# EAGLE board nedo1802_v1_0 (EAGLE 5.01), part 1 of 2
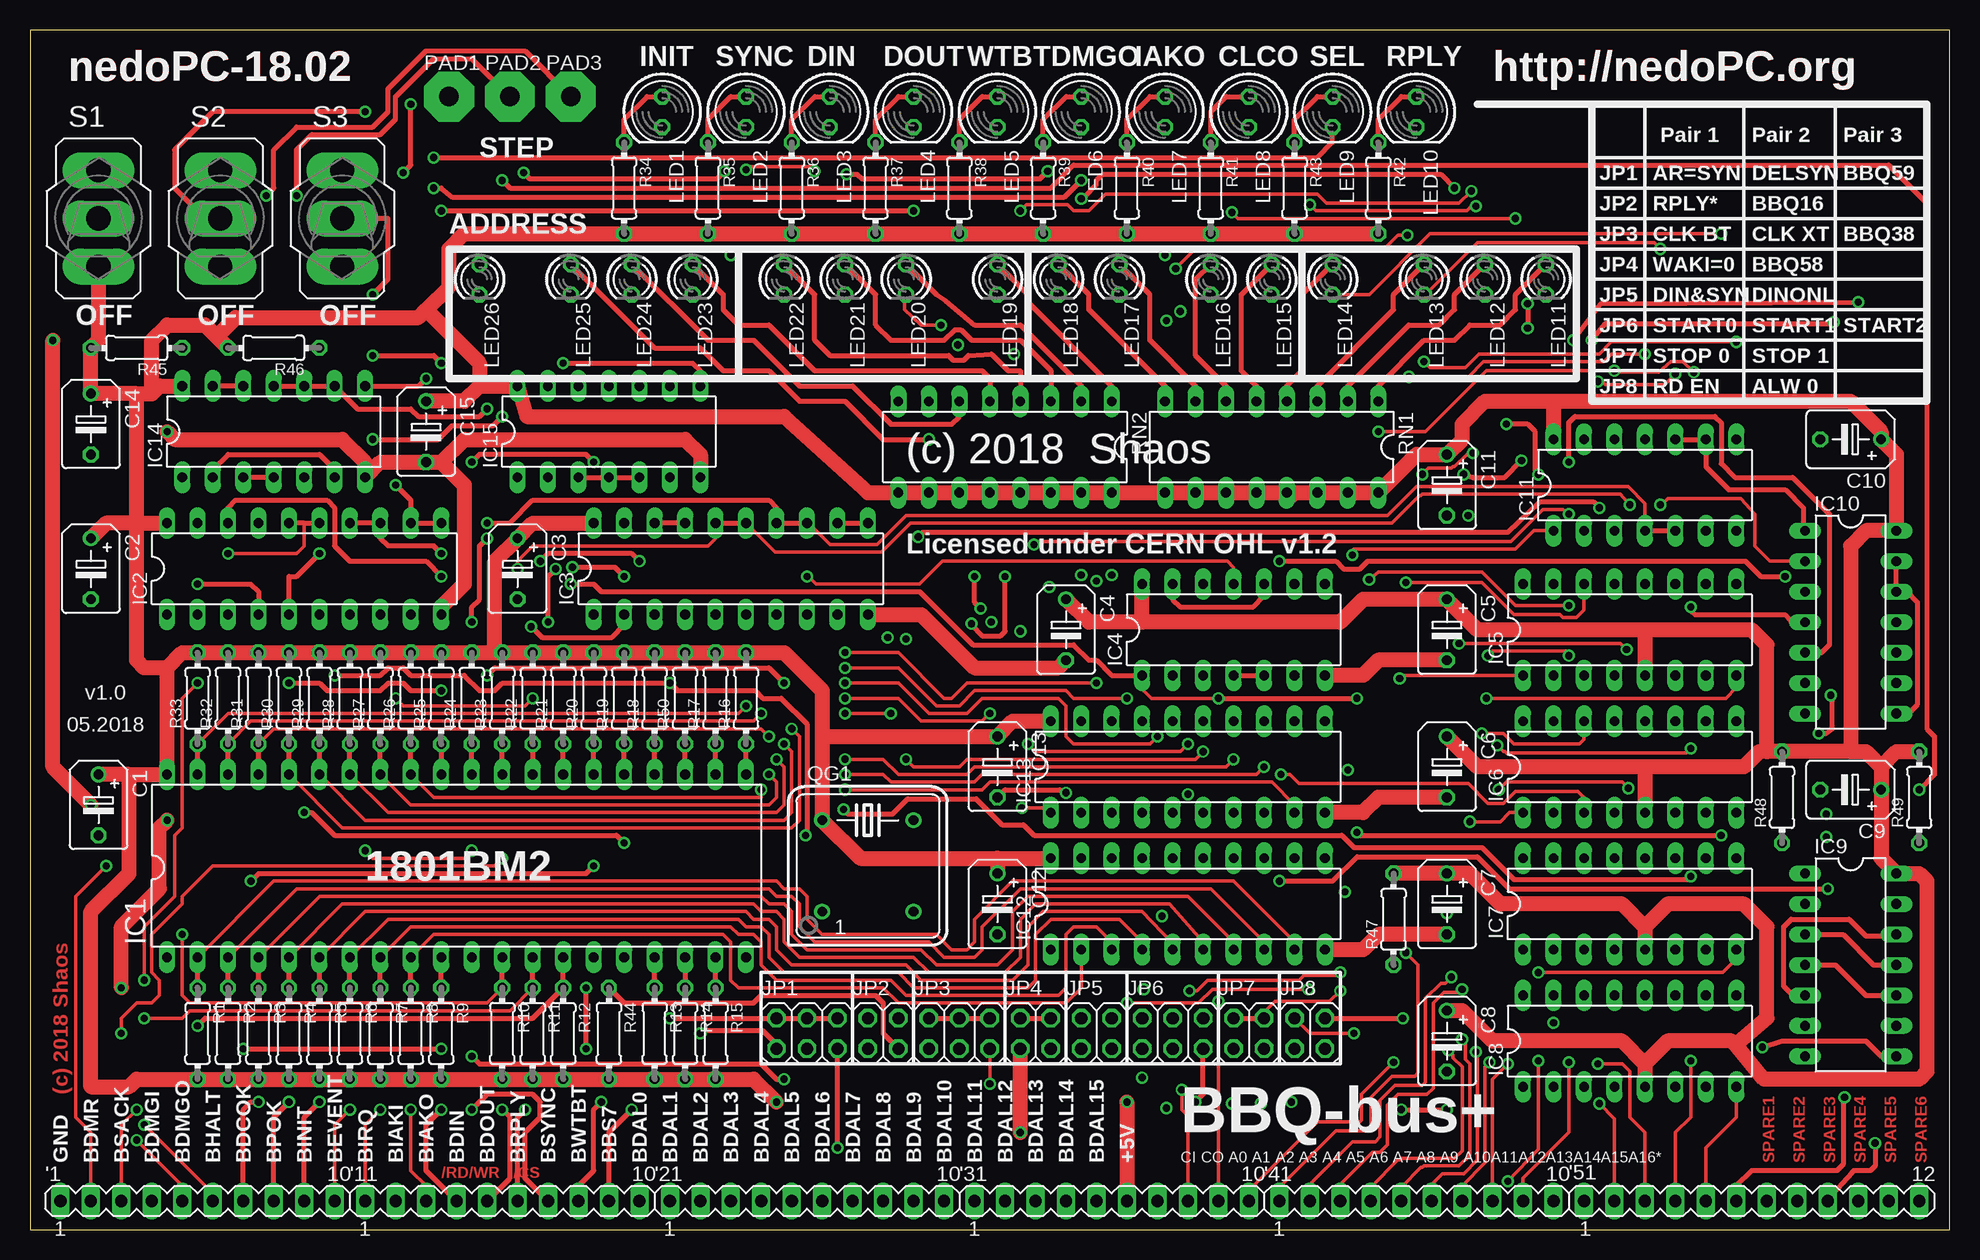
[diagram p2: board, top side]
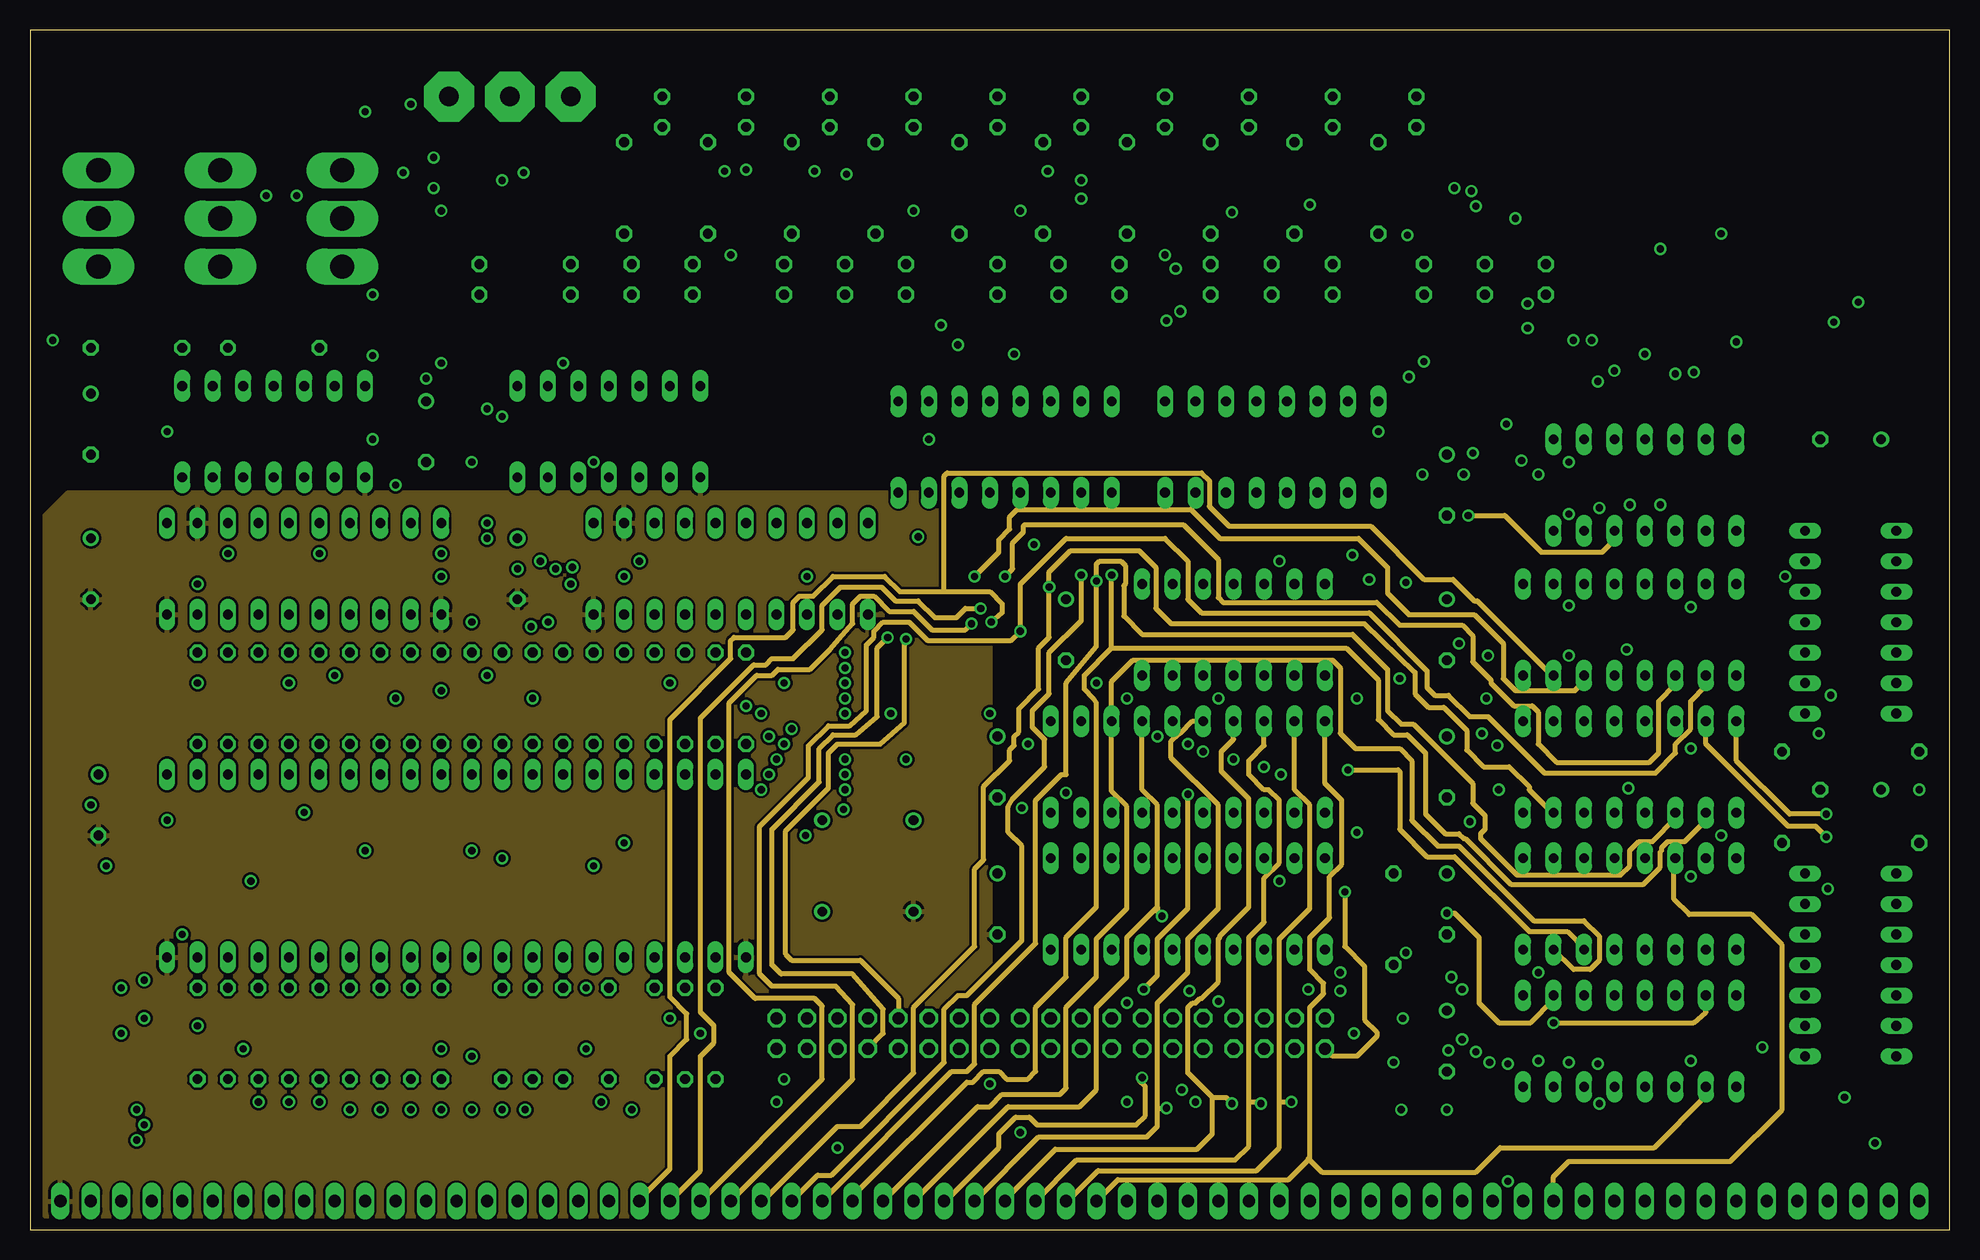
[diagram p3: board, inner layer Route2]
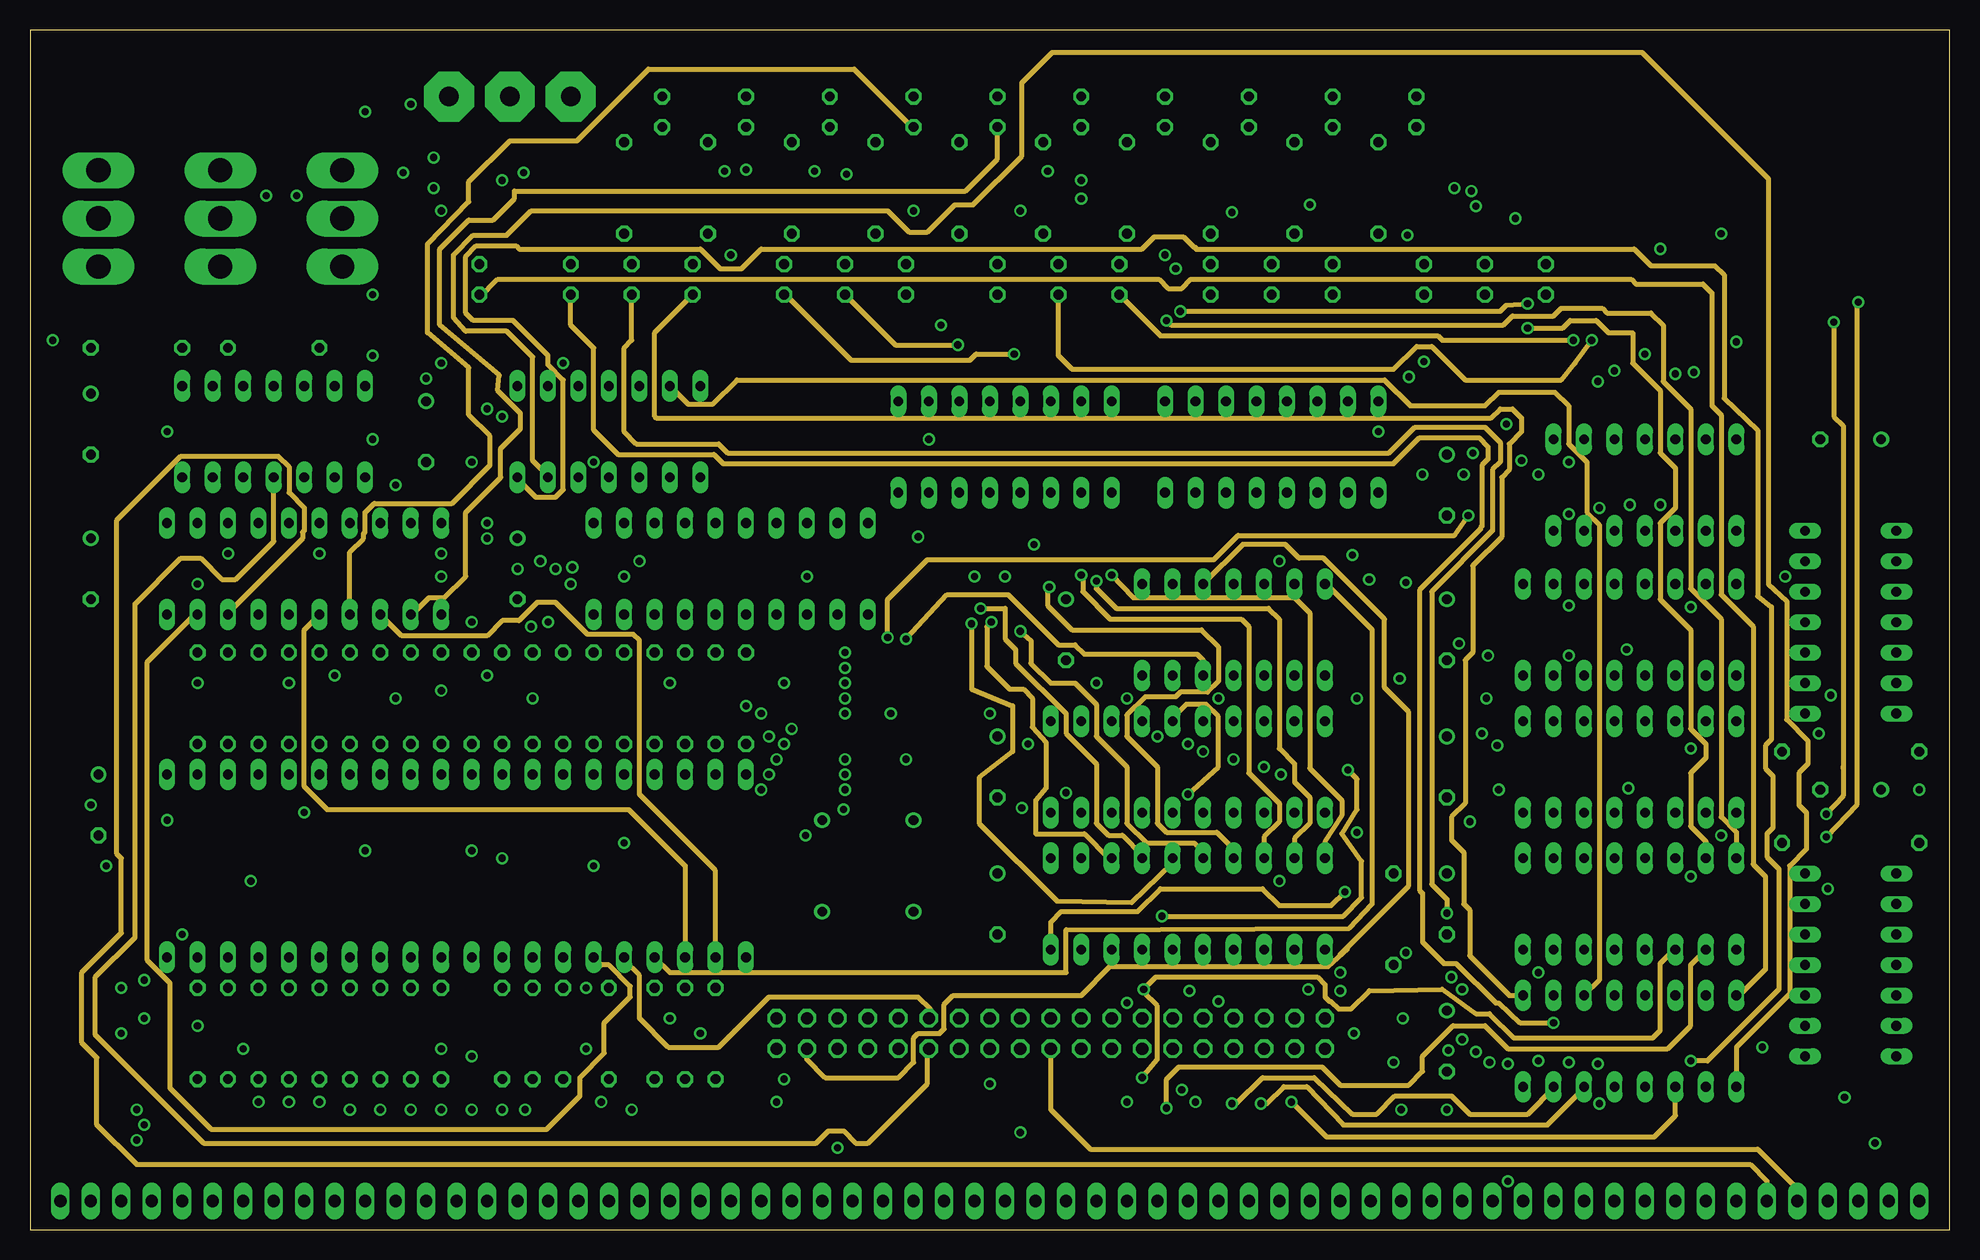
[diagram p4: board, inner layer Route15]
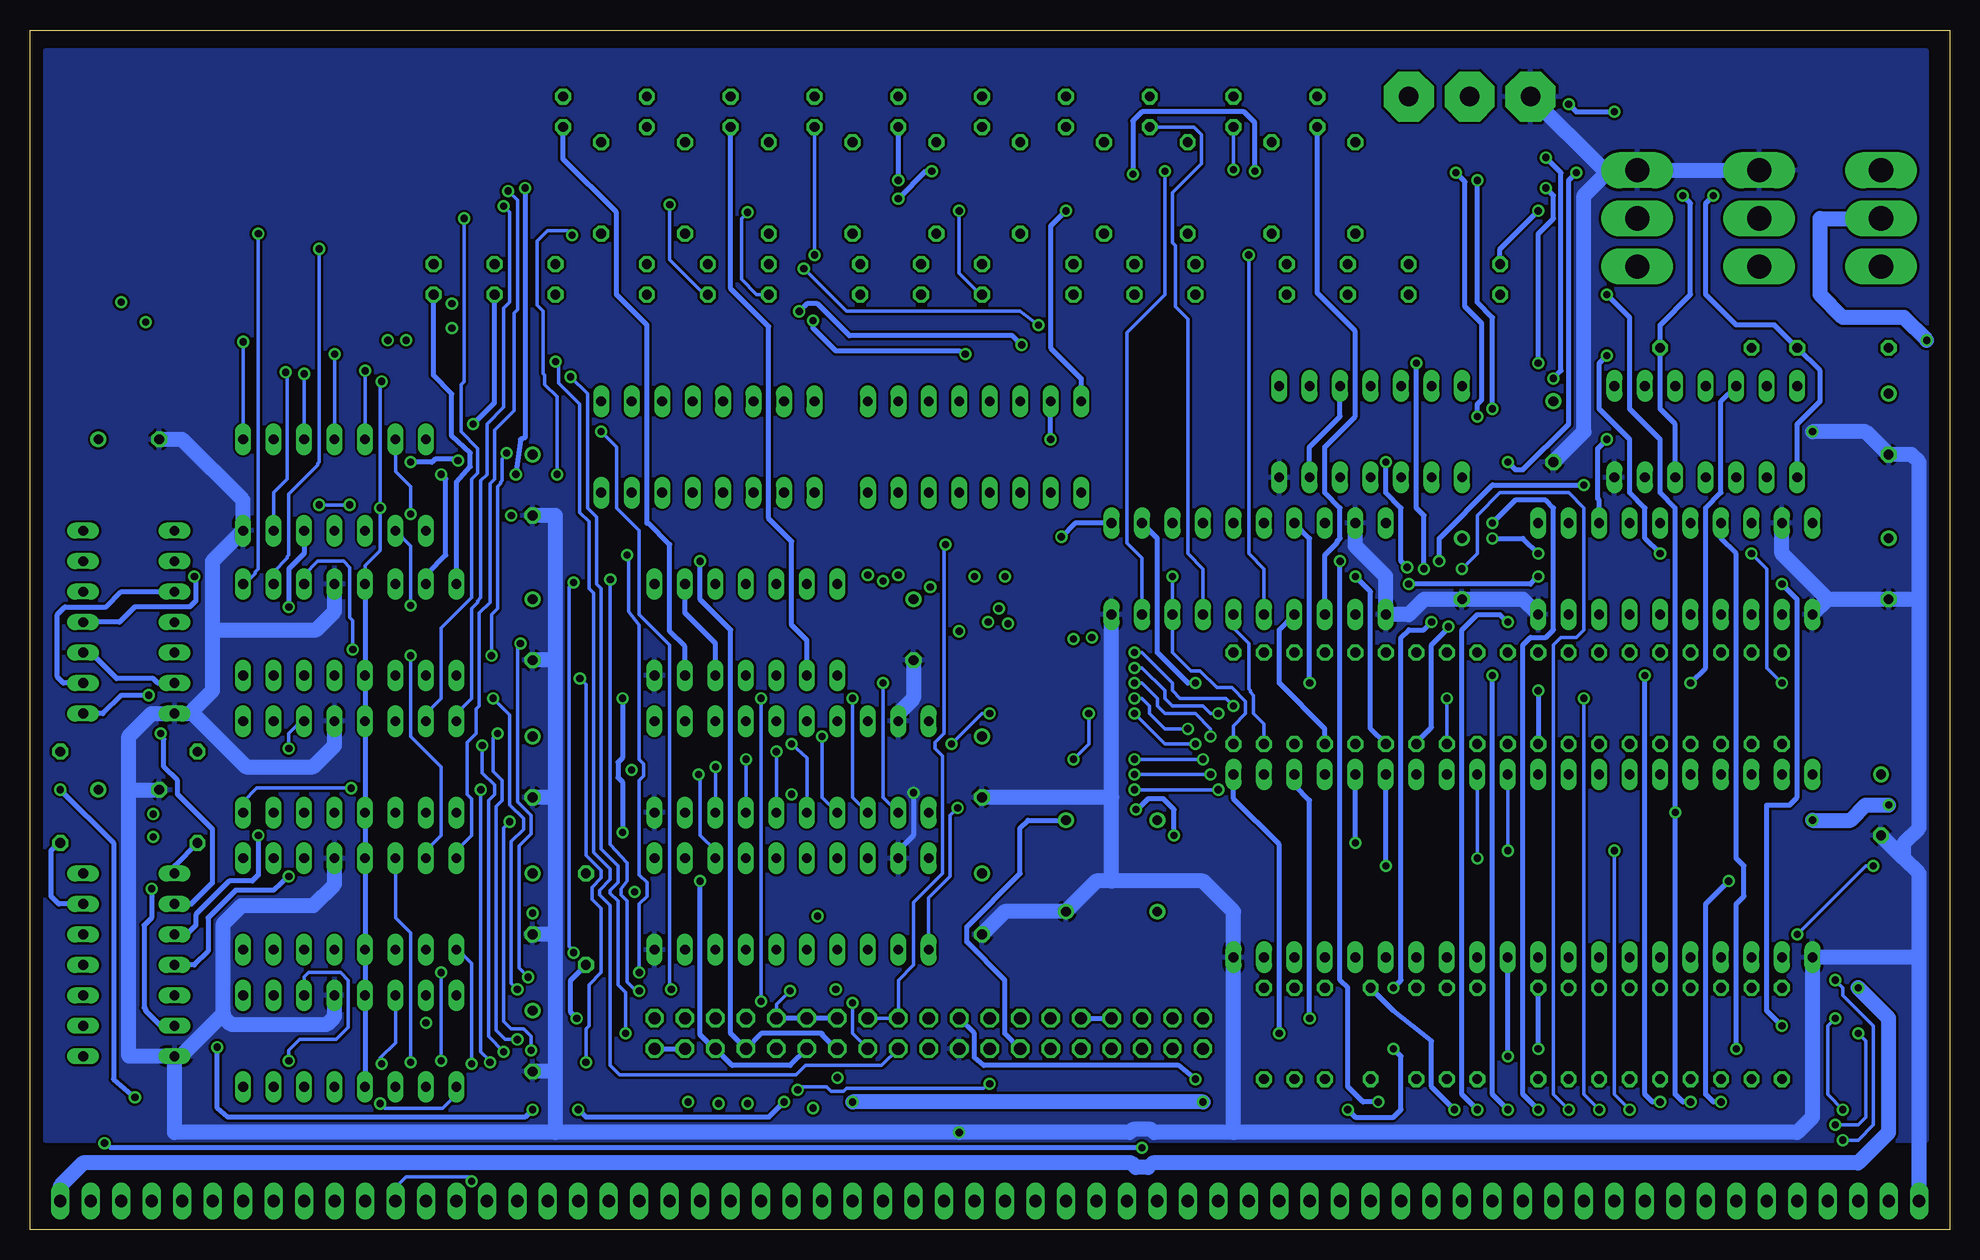
[diagram p5: board, bottom side, seen from below]

Size 160 x 100 mm. Coordinates in mm from the lower left corner, seen from the top.
Outline: 0,0 160,0 160,100 0,100 0,0
Copper layers (1+2*15+16): Top 0.035mm / dielectric 1.5mm / Route2 0.035mm / dielectric 0.15mm / Route15 0.035mm / dielectric 0.2mm / Bottom 0.035mm
Design rules "default *": minimum track width 6mil, minimum drill 20mil, track to track 8mil, track to pad 8mil, pad to pad 8mil, via to via 8mil, smd to smd 8mil, copper to edge 20mil, drill to drill 8mil, minimum pad ring 10mil, minimum via ring 8mil, stop-mask expansion 4mil, vias tented up to drill 0mil, thermal gap 10mil

## Footprints (pad centres in the part's own frame; a part is rotated, then mirrored left to right if it is on the bottom)
MA10-1 = drill 1.016 long: 1 -11.43,0; 2 -8.89,0; 3 -6.35,0; 4 -3.81,0; 5 -1.27,0; 6 1.27,0; 7 3.81,0; 8 6.35,0; 9 8.89,0; 10 11.43,0
MA12-1 = drill 1.016 long: 1 -13.97,0; 2 -11.43,0; 3 -8.89,0; 4 -6.35,0; 5 -3.81,0; 6 -1.27,0; 7 1.27,0; 8 3.81,0; 9 6.35,0; 10 8.89,0; 11 11.43,0; 12 13.97,0
B45181B = drill 0.813 round: + -2.54,0 | drill 0.813 octagon: - 2.54,0
DIL40 = drill 0.813 long: 1 -24.13,-7.62; 2 -21.59,-7.62; 3 -19.05,-7.62; 4 -16.51,-7.62; 5 -13.97,-7.62; 6 -11.43,-7.62; 7 -8.89,-7.62; 8 -6.35,-7.62; 9 -3.81,-7.62; 10 -1.27,-7.62; 11 1.27,-7.62; 12 3.81,-7.62; 13 6.35,-7.62; 14 8.89,-7.62; 15 11.43,-7.62; 16 13.97,-7.62; 17 16.51,-7.62; 18 19.05,-7.62; 19 21.59,-7.62; 20 24.13,-7.62; 21 24.13,7.62; 22 21.59,7.62; 23 19.05,7.62; 24 16.51,7.62; 25 13.97,7.62; 26 11.43,7.62; 27 8.89,7.62; 28 6.35,7.62; 29 3.81,7.62; 30 1.27,7.62; 31 -1.27,7.62; 32 -3.81,7.62; 33 -6.35,7.62; 34 -8.89,7.62; 35 -11.43,7.62; 36 -13.97,7.62; 37 -16.51,7.62; 38 -19.05,7.62; 39 -21.59,7.62; 40 -24.13,7.62
DIL20 = drill 0.813 long: 1 -11.43,-3.81; 2 -8.89,-3.81; 3 -6.35,-3.81; 4 -3.81,-3.81; 5 -1.27,-3.81; 6 1.27,-3.81; 7 3.81,-3.81; 8 6.35,-3.81; 9 8.89,-3.81; 10 11.43,-3.81; 11 11.43,3.81; 12 8.89,3.81; 13 6.35,3.81; 14 3.81,3.81; 15 1.27,3.81; 16 -1.27,3.81; 17 -3.81,3.81; 18 -6.35,3.81; 19 -8.89,3.81; 20 -11.43,3.81
DIL14 = drill 0.813 long: 1 -7.62,-3.81; 2 -5.08,-3.81; 3 -2.54,-3.81; 4 0,-3.81; 5 2.54,-3.81; 6 5.08,-3.81; 7 7.62,-3.81; 8 7.62,3.81; 9 5.08,3.81; 10 2.54,3.81; 11 0,3.81; 12 -2.54,3.81; 13 -5.08,3.81; 14 -7.62,3.81
DIL16 = drill 0.813 long: 1 -8.89,-3.81; 2 -6.35,-3.81; 3 -3.81,-3.81; 4 -1.27,-3.81; 5 1.27,-3.81; 6 3.81,-3.81; 7 6.35,-3.81; 8 8.89,-3.81; 9 8.89,3.81; 10 6.35,3.81; 11 3.81,3.81; 12 1.27,3.81; 13 -1.27,3.81; 14 -3.81,3.81; 15 -6.35,3.81; 16 -8.89,3.81
2X03 = drill 1.016 octagon: 1 -2.54,-1.27; 2 -2.54,1.27; 3 0,-1.27; 4 0,1.27; 5 2.54,-1.27; 6 2.54,1.27
2X02 = drill 1.016 octagon: 1 -1.27,-1.27; 2 -1.27,1.27; 3 1.27,-1.27; 4 1.27,1.27
LED5MM = drill 0.813 octagon: A -1.27,0; K 1.27,0
LED3MM = drill 0.813 octagon: A -1.27,0; K 1.27,0
4,16O1,6 = drill 1.6 pad 4.166 octagon: 1 0,0
DIL08S = drill 0.813 round: 1 -3.81,-3.81; 4 3.81,-3.81; 5 3.81,3.81; 8 -3.81,3.81
0204/7 = drill 0.813 octagon: 1 -3.81,0; 2 3.81,0
320-916 = drill 2.007 long: 1 0,4.013; 2 0,0; 3 0,-4.013

## Placement (x,y rotation side)
'1  [MA10-1]  13.97,2.38 0 top
'11  [MA10-1]  39.37,2.38 0 top
'21  [MA10-1]  64.77,2.38 0 top
'31  [MA10-1]  90.16,2.38 0 top
'41  [MA10-1]  115.56,2.38 0 top
'51  [MA12-1]  143.5,2.38 0 top
C1  0.1  [B45181B]  5.71,35.39 270 top
C2  0.1  [B45181B]  5.08,55.08 270 top
C3  0.1  [B45181B]  40.64,55.08 270 top
C4  0.1  [B45181B]  86.35,50 270 top
C5  0.1  [B45181B]  118.1,50 270 top
C6  0.1  [B45181B]  118.1,38.57 270 top
C7  0.1  [B45181B]  118.1,27.14 270 top
C8  0.1  [B45181B]  118.1,15.71 270 top
C9  0.1  [B45181B]  151.76,36.66 180 top
C10  0.1  [B45181B]  151.76,65.88 180 top
C11  0.1  [B45181B]  118.1,62.06 270 top
C12  0.1  [B45181B]  80.64,27.14 270 top
C13  0.1  [B45181B]  80.64,38.57 270 top
C14  0.1  [B45181B]  5.08,67.14 270 top
C15  0.1  [B45181B]  33.02,66.51 270 top
IC1  1801BM2  [DIL40]  35.55,30.31 0 top
IC2  74LS244N  [DIL20]  22.86,55.08 0 top
IC3  74LS244N  [DIL20]  58.41,55.08 0 top
IC4  74LS04N  [DIL14]  100.32,50 0 top
IC5  74LS75N  [DIL16]  133.34,50 0 top
IC6  74LS75N  [DIL16]  133.34,38.57 0 top
IC7  74LS75N  [DIL16]  133.34,27.14 0 top
IC8  74LS75N  [DIL16]  133.34,15.71 0 top
IC9  74LS74N  [DIL14]  151.76,22.06 270 top
IC10  74LS00N  [DIL14]  151.76,50.63 270 top
IC11  74LS00N  [DIL14]  134.62,62.06 0 top
IC12  74LS245N  [DIL20]  96.52,27.14 0 top
IC13  74LS245N  [DIL20]  96.52,38.57 0 top
IC14  74LS00N  [DIL14]  20.31,66.51 0 top
IC15  74LS00N  [DIL14]  48.26,66.51 0 top
JP1  [2X03]  64.77,16.34 0 top
JP2  [2X02]  71.11,16.34 0 top
JP3  [2X03]  77.46,16.34 0 top
JP4  [2X02]  83.81,16.34 0 top
JP5  [2X02]  88.89,16.34 0 top
JP6  [2X03]  95.24,16.34 0 top
JP7  [2X02]  101.59,16.34 0 top
JP8  [2X02]  106.67,16.34 0 top
LED1  [LED5MM]  52.7,93.18 270 top
LED2  [LED5MM]  59.69,93.18 270 top
LED3  [LED5MM]  66.67,93.18 270 top
LED4  [LED5MM]  73.66,93.18 270 top
LED5  [LED5MM]  80.64,93.18 270 top
LED6  [LED5MM]  87.62,93.18 270 top
LED7  [LED5MM]  94.61,93.18 270 top
LED8  [LED5MM]  101.59,93.18 270 top
LED9  [LED5MM]  108.58,93.18 270 top
LED10  [LED5MM]  115.56,93.18 270 top
LED11  [LED3MM]  126.36,79.21 270 top
LED12  [LED3MM]  121.28,79.21 270 top
LED13  [LED3MM]  116.2,79.21 270 top
LED14  [LED3MM]  108.58,79.21 270 top
LED15  [LED3MM]  103.5,79.21 270 top
LED16  [LED3MM]  98.42,79.21 270 top
LED17  [LED3MM]  90.8,79.21 270 top
LED18  [LED3MM]  85.72,79.21 270 top
LED19  [LED3MM]  80.64,79.21 270 top
LED20  [LED3MM]  73.02,79.21 270 top
LED21  [LED3MM]  67.94,79.21 270 top
LED22  [LED3MM]  62.86,79.21 270 top
LED23  [LED3MM]  55.24,79.21 270 top
LED24  [LED3MM]  50.16,79.21 270 top
LED25  [LED3MM]  45.08,79.21 270 top
LED26  [LED3MM]  37.46,79.21 270 top
PAD1  CO  [4,16O1,6]  34.92,94.45 0 top
PAD2  NO  [4,16O1,6]  40,94.45 0 top
PAD3  NC  [4,16O1,6]  45.08,94.45 0 top
QG1  [DIL08S]  69.84,30.31 0 top
R1  2K  [0204/7]  13.97,16.34 270 top
R2  2K  [0204/7]  16.5,16.34 270 top
R3  2K  [0204/7]  19.04,16.34 270 top
R4  2K  [0204/7]  21.58,16.34 270 top
R5  2K  [0204/7]  24.12,16.34 270 top
R6  2K  [0204/7]  26.66,16.34 270 top
R7  2K  [0204/7]  29.2,16.34 270 top
R8  2K  [0204/7]  31.74,16.34 270 top
R9  2K  [0204/7]  34.29,16.34 270 top
R10  2K  [0204/7]  39.37,16.34 270 top
R11  2K  [0204/7]  41.91,16.34 270 top
R12  2K  [0204/7]  44.45,16.34 270 top
R13  2K  [0204/7]  52.07,16.34 270 top
R14  2K  [0204/7]  54.61,16.34 270 top
R15  2K  [0204/7]  57.15,16.34 270 top
R16  2K  [0204/7]  59.69,44.28 90 top
R17  2K  [0204/7]  57.15,44.28 90 top
R18  2K  [0204/7]  52.07,44.28 90 top
R19  2K  [0204/7]  49.53,44.28 90 top
R20  2K  [0204/7]  46.98,44.28 90 top
R21  2K  [0204/7]  44.45,44.28 90 top
R22  2K  [0204/7]  41.91,44.28 90 top
R23  2K  [0204/7]  39.37,44.28 90 top
R24  2K  [0204/7]  36.83,44.28 90 top
R25  2K  [0204/7]  34.29,44.28 90 top
R26  2K  [0204/7]  31.74,44.28 90 top
R27  2K  [0204/7]  29.2,44.28 90 top
R28  2K  [0204/7]  26.66,44.28 90 top
R29  2K  [0204/7]  24.12,44.28 90 top
R30  2K  [0204/7]  21.58,44.28 90 top
R31  2K  [0204/7]  19.04,44.28 90 top
R32  2K  [0204/7]  16.5,44.28 90 top
R33  2K  [0204/7]  13.97,44.28 90 top
R34  1K  [0204/7]  49.53,86.83 270 top
R35  1K  [0204/7]  56.51,86.83 270 top
R36  1K  [0204/7]  63.5,86.83 270 top
R37  1K  [0204/7]  70.48,86.83 270 top
R38  1K  [0204/7]  77.46,86.83 270 top
R39  1K  [0204/7]  84.45,86.83 270 top
R40  1K  [0204/7]  91.44,86.83 270 top
R41  1K  [0204/7]  98.42,86.83 270 top
R42  1K  [0204/7]  112.39,86.83 270 top
R43  1K  [0204/7]  105.41,86.83 270 top
R44  2K  [0204/7]  48.26,16.34 270 top
R45  2K  [0204/7]  8.89,73.5 180 top
R46  2K  [0204/7]  20.31,73.5 180 top
R47  2K  [0204/7]  113.66,25.87 90 top
R48  2K  [0204/7]  146.04,36.03 90 top
R49  2K  [0204/7]  157.47,36.03 90 top
R50  2K  [0204/7]  54.61,44.28 90 top
RN1  [DIL16]  103.5,65.24 180 top
RN2  [DIL16]  81.27,65.24 180 top
S1  [320-916]  5.71,84.29 0 top
S2  [320-916]  15.87,84.29 0 top
S3  [320-916]  26.03,84.29 0 top

## Tracks (layer width: path | path; a pad name or v marks a point on that pad's centre or on a via)
!ACLO  (via drill 0.6)
  Top 0.406: IC1.25 R19.1 | '1.8 20.31,9.36 v21.58,10.63 | v49.53,32.22 48.89,32.85 25.39,32.85 23.49,34.76 v22.86,34.76 | S3.2 29.84,84.29 29.84,79.21 v28.57,77.94
  Bottom 0.406: v21.58,10.63 22.22,10.63 22.86,11.27 v22.86,34.76 22.86,60.16 24.12,61.43 24.12,65.88 26.66,68.41 26.66,76.03 v28.57,77.94 | v49.53,32.22 IC1.25
!AD0
  Top 0.305: IC1.9 33.65,24.6 57.78,24.6 58.41,23.96 58.41,20.79 59.05,20.15 71.11,20.15 72.38,18.88 86.35,18.88 87.62,20.15 IC12.2
  Top 0.406: R8.1 IC1.9
!AD1
  Top 0.305: IC1.8 31.74,25.23 58.41,25.23 59.05,24.6 60.32,24.6 60.96,23.96 60.96,22.06 62.23,20.79 71.75,20.79 73.02,19.52 85.72,19.52 86.35,20.15 86.35,24.6 86.99,25.23 88.89,25.23 90.16,23.96 IC12.3
  Top 0.406: R7.1 IC1.8
!AD2
  Top 0.305: IC1.7 29.84,25.87 59.05,25.87 59.69,25.23 60.96,25.23 61.59,24.6 61.59,22.7 62.86,21.42 72.38,21.42 73.66,20.15 83.18,20.15 83.81,20.79 83.81,24.6 85.08,25.87 90.8,25.87 92.7,23.96 IC12.4
  Top 0.406: R6.1 IC1.7
!AD3
  Top 0.305: IC1.6 27.93,26.5 59.69,26.5 60.32,25.87 61.59,25.87 62.23,25.23 62.23,23.33 63.5,22.06 73.02,22.06 74.29,20.79 81.91,20.79 83.18,22.06 83.18,25.23 84.45,26.5 92.7,26.5 95.24,23.84 IC12.5
  Top 0.406: R5.1 IC1.6
!AD4
  Top 0.305: IC1.5 26.03,27.14 60.32,27.14 60.96,26.5 62.23,26.5 62.86,25.87 62.86,23.96 64.13,22.7 73.66,22.7 74.92,21.42 81.27,21.42 82.55,22.7 82.55,25.87 83.81,27.14 94.99,27.14 97.78,23.96 IC12.6
  Top 0.406: R4.1 IC1.5
!AD5
  Top 0.305: IC1.4 24.12,27.77 60.96,27.77 61.59,27.14 62.86,27.14 63.5,26.5 63.5,24.6 64.77,23.33 74.29,23.33 75.56,22.06 80.64,22.06 81.91,23.33 81.91,26.5 83.18,27.77 96.52,27.77 100.32,23.96 IC12.7
  Top 0.406: R3.1 IC1.4
!AD6
  Top 0.305: IC1.3 22.22,28.41 61.59,28.41 62.23,27.77 63.5,27.77 64.13,27.14 64.13,25.23 65.4,23.96 74.92,23.96 76.19,22.7 78.73,22.7 79.37,23.33 79.37,25.23 82.55,28.41 98.42,28.41 102.86,23.96 IC12.8
  Top 0.406: R2.1 IC1.3
!AD7
  Top 0.305: IC1.2 20.31,29.04 62.23,29.04 62.86,28.41 64.13,28.41 64.77,27.77 64.77,25.87 66.03,24.6 75.56,24.6 76.83,23.33 78.1,23.33 78.73,23.96 78.73,25.87 81.91,29.04 100.32,29.04 105.41,23.96 IC12.9
  Top 0.406: R1.1 IC1.2
!AD8  (via drill 0.6)
  Top 0.305: R33.1 16.5,43.02 59.05,43.02 v59.69,43.65 | v67.94,48.09 72.38,48.09 76.19,44.28 76.83,44.28 78.1,45.55 v88.89,45.55
  Top 0.406: IC1.39 R33.1
  Bottom 0.305: v59.69,43.65 60.32,44.28 64.13,44.28 64.77,44.92 64.77,45.55 67.3,48.09 v67.94,48.09 | v88.89,45.55 88.89,36.03 IC13.2
!AD9  (via drill 0.6)
  Top 0.305: R32.1 18.41,42.38 60.32,42.38 v60.96,43.02 | v67.94,46.82 72.38,46.82 75.56,43.65 77.46,43.65 78.73,44.92 86.35,44.92 86.99,44.28 v91.44,44.28
  Top 0.406: IC1.38 R32.1
  Bottom 0.305: v60.96,43.02 61.59,43.02 62.23,43.65 64.77,43.65 65.4,44.28 65.4,44.92 67.3,46.82 v67.94,46.82 | v91.44,44.28 91.44,36.03 IC13.3
!AD10  (via drill 0.6)
  Top 0.305: R31.1 20.31,41.74 60.96,41.74 v61.59,41.11 | v67.94,45.55 72.38,45.55 74.92,43.02 78.1,43.02 79.37,44.28 85.72,44.28 86.35,43.65 86.35,41.11 86.99,40.48 93.34,40.48 v93.97,41.11
  Top 0.406: IC1.37 R31.1
  Bottom 0.305: v61.59,41.11 61.59,41.74 62.86,43.02 65.4,43.02 66.03,43.65 66.03,44.28 67.3,45.55 v67.94,45.55 | v93.97,41.11 93.97,36.03 IC13.4
!AD11  (via drill 0.6)
  Top 0.305: IC1.36 26.03,33.49 63.5,33.49 64.13,34.12 64.13,41.11 v63.5,41.74 | v67.94,44.28 72.38,44.28 74.29,42.38 79.37,42.38 v80,43.02 | v83.18,40.48 83.81,39.84 95.88,39.84 v96.52,40.48
  Top 0.406: IC1.36 R30.1
  Bottom 0.305: v63.5,41.74 65.4,41.74 66.67,43.02 66.67,43.65 67.3,44.28 v67.94,44.28 | v80,43.02 80.64,43.02 v83.18,40.48 | v96.52,40.48 95.24,39.33 IC13.5
!AD12  (via drill 0.6)
  Top 0.305: IC1.35 27.93,34.12 62.86,34.12 63.5,34.76 63.5,39.84 v62.86,40.48 | v67.94,43.02 v71.75,43.02 | v73.02,39.2 73.66,38.57 77.46,38.57 78.1,39.2 97.15,39.2 v97.78,39.84
  Top 0.406: IC1.35 R29.1
  Bottom 0.305: v62.86,40.48 65.4,40.48 v67.94,43.02 | v71.75,43.02 71.75,40.48 v73.02,39.2 | v97.78,39.84 IC13.6
!AD13  (via drill 0.6)
  Top 0.305: IC1.34 29.84,34.76 62.23,34.76 62.86,35.39 62.86,38.57 v62.23,39.2 | v67.94,39.2 71.11,39.2 72.38,37.94 78.1,37.94 78.73,38.57 99.69,38.57 v100.32,39.2
  Top 0.406: IC1.34 R28.1
  Bottom 0.305: v62.23,39.2 v67.94,39.2 | v100.32,39.2 IC13.7
!AD14  (via drill 0.6)
  Top 0.305: IC1.33 31.74,35.39 61.59,35.39 62.23,36.03 62.23,37.3 v61.59,37.94 | v67.94,37.94 71.11,37.94 71.75,37.3 78.73,37.3 79.37,37.94 102.23,37.94 v102.86,38.57
  Top 0.406: IC1.33 R27.1
  Bottom 0.305: v61.59,37.94 v67.94,37.94 | v102.86,38.57 IC13.8
!AD15  (via drill 0.6)
  Top 0.305: IC1.32 33.65,36.03 60.96,36.03 v60.96,36.66 | v67.94,36.66 79.37,36.66 80,37.3 103.5,37.3 105.41,35.39 IC13.9
  Top 0.406: IC1.32 R26.1
  Bottom 0.305: v60.96,36.66 v67.94,36.66
!AR  (via drill 0.6)
  Top 0.406: IC1.23 R50.1 | JP1.6 JP1.4 JP1.2 v53.34,17.61
  Bottom 0.406: v53.34,17.61 53.34,35.78 54.61,37.05 IC1.23
!DCLO  (via drill 0.6)
  Top 0.406: IC1.26 R20.1 | '1.7 17.77,10 18.41,10.63 v19.04,10.63 | v18.41,29.04 19.04,29.68 46.35,29.68 v46.98,30.31 | S2.2 14.6,84.29 12.06,86.83 12.06,90 15.24,93.18 v27.93,93.18 | v31.74,93.81 31.74,88.73 v31.11,88.1 | v36.83,63.97 37.46,64.61 46.35,64.61 v46.98,63.97 | v45.21,55.21 48.76,55.21 v49.53,54.45
  Bottom 0.406: v19.04,10.63 19.68,10.63 20.31,11.27 20.31,27.14 v18.41,29.04 | v46.98,30.31 IC1.26 | v27.93,93.18 31.11,93.18 v31.74,93.81 | v31.11,88.1 31.74,87.47 31.74,67.14 35.55,63.34 36.19,63.34 v36.83,63.97 | v46.98,63.97 46.98,61.43 45.72,60.16 45.72,55.71 v45.21,55.21 | v49.53,54.45 48.26,53.17 48.26,41.74 R20.1
!DIN
  Top 0.406: IC1.22 R17.1
  Bottom 0.305: R17.1 57.15,42.13 58.03,43.02 58.03,44.54 58.29,44.79 58.29,44.92 58.41,45.05 58.41,48.86 59.69,50.13 IC3.6
!DMGO  (via drill 0.6)
  Top 0.406: v13.97,16.98 14.6,17.61 41.91,17.61 R12.1 IC1.14 | v13.97,53.81 18.41,53.81 19.04,53.17 IC2.4
  Bottom 0.406: v13.97,16.98 15.24,18.25 15.24,35.39 13.33,35.39 12.7,36.03 12.7,52.54 v13.97,53.81
!DMR  (via drill 0.6)
  Top 0.305: '1.2 5.08,8.09 3.8,9.36 3.8,27.77 v6.34,30.31 | v12.7,24.6 12.7,19.52 13.33,18.88 38.1,18.88 R10.1
  Top 0.406: R10.1 IC1.12
  Bottom 0.305: v6.34,30.31 6.98,30.31 v12.7,24.6
!DOUT
  Top 0.406: IC1.18 R14.1
  Route15 0.406: IC2.6 22.86,50 22.86,36.92 24.76,35.01 49.91,35.01 54.61,30.31 IC1.18 54.73,22.57
!EVNT  (via drill 0.6)
  Top 0.305: '1.10 25.39,8.73 v26.66,10 | v27.93,31.58 28.57,30.95 36.19,30.95 v36.83,31.58
  Top 0.406: IC1.30 R24.1
  Bottom 0.305: v26.66,10 27.93,11.27 v27.93,31.58 | v36.83,31.58 IC1.30
!HALT  (via drill 0.6)
  Top 0.305: '1.6 15.24,3.01 v9.52,8.73 | v7.62,16.34 7.62,17.61 8.89,18.88 10.16,18.88 10.79,19.52 10.79,20.79 10.16,21.42 10.16,24.6 12.7,27.14 12.7,27.77 15.24,30.31 38.73,30.31 v39.37,30.95
  Top 0.406: IC1.29 R23.1
  Bottom 0.305: v9.52,8.73 7.62,8.73 6.98,9.36 6.98,15.71 v7.62,16.34 | v39.37,30.95 IC1.29
!IAKO
  Top 0.406: IC1.24 R18.1
  Bottom 0.406: R18.1 52.07,41.74 55.88,45.55 55.88,50 IC3.4
!INIT  (via drill 0.6)
  Top 0.406: IC1.27 R21.1 | IC3.2 49.53,50.38 48.51,49.37 42.67,49.37 v41.78,50.25
  Bottom 0.406: v41.78,50.25 41.78,50.13 43.18,48.73 43.18,41.87 44.57,40.48 R21.1
!RPLY
  Top 0.406: R13.1 IC1.17
  Route15 0.406: IC1.17 53.34,21.42 86.35,21.42 86.35,24.98 109.98,25.11 111.88,27.14 111.88,50 108.07,53.81 IC4.8
!RPLY2  (via drill 0.6)
  Route2 0.406: JP2.1 71.11,16.34 71.11,18.38 68.57,21.3 62.61,21.3 61.84,22.06 61.84,31.46 | 61.84,31.46 61.84,31.58 | v71.5,49.37 70.61,48.48 70.61,42.76 68.83,41.24 66.92,41.24 65.78,40.09 65.78,37.3 61.84,33.36 61.84,31.46 | v119.88,59.52 122.93,59.52 125.98,56.48 131.06,56.48 132.07,57.49 IC11.3
  Route15 0.406: v71.5,49.37 71.5,52.54 74.8,55.84 98.67,55.84 100.71,57.87 118.74,57.87 v119.88,59.52
!SACK  (via drill 0.6)
  Top 0.305: '1.3 7.62,8.73 v8.89,10 | v9.52,17.61 12.7,17.61 13.33,18.25 40,18.25 R11.1
  Top 0.406: R11.1 IC1.13
  Bottom 0.305: v8.89,10 10.16,11.27 10.16,16.98 v9.52,17.61
!SEL  (via drill 0.6)
  Top 0.406: R25.1 IC1.31 | IC14.12 IC14.13 | v34.29,44.92 31.74,44.92 31.11,45.55 29.84,45.55 29.2,44.92 24.76,44.92 24.12,45.55 v21.58,45.55
  Bottom 0.406: v34.29,44.92 R25.1 | v21.58,45.55 20.31,46.82 20.31,60.16 19.04,61.43 19.04,69.05 IC14.12
!SELBUF  (via drill 0.6)
  Top 0.406: LED9.K 108.58,90.64 107.31,89.37 v33.65,89.37 | v33.02,70.95 32.38,70.32 IC14.8
  Bottom 0.406: v33.65,89.37 32.38,88.1 32.38,71.59 v33.02,70.95
!SYNC  (via drill 0.6)
  Top 0.305: v64.77,54.45 64.89,54.45 65.53,53.81 74.16,53.81 76.07,55.71 99.82,55.71 100.32,55.21 IC4.11
  Top 0.406: IC1.21 R16.1 | JP1.1 62.23,15.46 61.08,16.6 56.13,16.6 v55.88,16.34
  Bottom 0.305: R16.1 59.69,42 58.67,43.02 58.67,44.03 59.81,45.17 61.08,45.17 62.48,46.57 63.24,46.57 64.77,48.09 IC3.8 v64.77,54.45
  Bottom 0.406: v55.88,16.34 55.88,32.09 59.69,35.9 IC1.21
!VIRQ  (via drill 0.6)
  Top 0.305: '11.1 27.93,8.73 v29.2,10 | v30.47,44.28 31.11,43.65 41.27,43.65 v41.91,44.28
  Top 0.406: R22.1 IC1.28
  Bottom 0.305: v29.2,10 30.47,11.27 v30.47,44.28 | v41.91,44.28 R22.1
!WAKI  (via drill 0.6)
  Top 0.406: v36.83,14.44 37.46,13.81 60.96,13.81 62.23,12.54 v62.86,12.54 | JP4.2 JP4.4
  Bottom 0.406: v36.83,14.44 IC1.11 | v62.86,12.54 64.26,13.68 80.51,13.68 81.27,14.31 81.27,16.34 JP4.2
!WRQ  (via drill 0.6)
  Top 0.406: v17.77,15.08 v34.29,15.08 | 34.41,20.15 34.54,20.03 | R9.1 34.41,20.15 | IC1.10 34.29,20.28 34.41,20.15
  Bottom 0.406: v34.29,15.08 R9.1 | v17.77,15.08 17.77,27.14 17.14,27.77 17.14,30.31 17.77,30.95 17.77,56.35 19.04,57.62 IC2.17
!WTBT
  Top 0.406: R15.1 IC1.19
  Route15 0.406: IC1.19 57.15,29.93 50.8,36.28 50.8,49.11 50.29,49.62 46.48,49.62 43.81,52.29 42.29,52.29 40.76,50.76 39.37,50.76 38.1,49.49 30.98,49.49 IC2.8 29.08,51.4
BBQ5  (via drill 0.6)
  Top 0.305: '1.5 12.7,3.64 v8.89,7.46 | v9.52,20.79 9.52,25.23 12.06,27.77 12.06,32.85 12.7,33.49 12.7,44.28 v13.97,45.55 | v16.5,56.35 22.22,56.35 22.86,56.98 22.86,58.89
  Top 0.406: IC2.16 22.86,58.89 IC2.15
  Bottom 0.305: v8.89,7.46 7.62,7.46 6.34,8.73 6.34,16.98 8.89,19.52 8.89,20.15 v9.52,20.79 | v13.97,45.55 15.24,46.82 15.24,55.08 v16.5,56.35
BBQ9  (via drill 0.6)
  Top 0.406: IC3.17 IC3.18 | '1.9 22.86,9.36 v24.12,10.63 | v25.39,46.19 29.2,46.19 29.84,46.82 31.11,46.82 31.74,46.19 36.19,46.19 37.46,44.92 38.73,44.92 39.37,45.55 v53.34,45.55 53.97,44.92 60.45,44.92 61.08,44.28 62.61,44.28 64.77,42.13 64.77,32.98 v64.64,32.85 | IC9.4 150.49,22.06 153.03,19.52 IC9.10 | v138.42,29.43 138.17,29.17 123.69,29.17 121.03,31.84 110.36,31.84 109.34,32.85 83.69,32.85 82.8,33.74 81.02,33.74 78.86,35.9 73.15,35.9 71.88,34.63 68.19,34.63 v67.81,35.01
  Bottom 0.406: v24.12,10.63 24.76,10.63 25.39,11.27 v25.39,46.19 | v53.34,45.55 53.34,57.62 IC3.17 | IC9.4 146.3,22.06 145.16,23.2 145.16,26 142.87,28.28 139.69,28.28 v138.42,29.43 | v67.81,35.01 67.69,35.01 66.8,35.9 65.53,35.9 64.64,35.01 v64.64,32.85
BBQ13  (via drill 0.6)
  Top 0.305: '11.3 33.02,3.64 31.74,4.92 v31.74,10 | v40.64,55.08 40.64,55.71 41.91,56.98 56.51,56.98 57.15,57.62 IC3.16 | IC3.15 62.1,56.48 70.99,56.48 73.4,58.89 113.53,58.89 115.82,61.18 115.95,61.18 116.07,61.3 132.58,61.3 v133.34,60.41 | v135.88,60.41 136.01,60.41 136.52,60.92 142.62,60.92 143.76,59.65 143.76,56.98 145.03,55.71 IC10.2
  Top 0.406: IC3.16 IC3.15
  Bottom 0.305: v31.74,10 33.02,11.27 33.02,48.73 32.38,49.37 31.11,49.37 30.47,50 30.47,60.16 31.74,61.43 37.46,61.43 39.37,59.52 39.37,56.35 v40.64,55.08 | v133.34,60.41 v135.88,60.41
BBQ14  (via drill 0.6)
  Top 0.305: IC3.13 64.89,58.89 66.67,57.11 70.61,57.11 73.02,59.52 113.15,59.52 115.56,61.94 133.22,61.94 134.62,60.54 IC11.4
  Top 0.406: '11.4 33.02,4.92 33.02,8.73 v34.29,10 | v38.1,58.89 40,58.89 41.91,60.8 61.59,60.8 62.23,60.16 IC3.14 IC3.13 | IC11.4 134.62,58.13 134.74,58.25 IC11.5 | IC10.4 146.81,50.63 146.3,51.27 138.81,51.27 138.42,51.52 v138.42,51.91
  Bottom 0.406: v34.29,10 35.55,11.27 35.55,48.73 34.92,49.37 33.65,49.37 33.02,50 33.02,60.16 33.65,60.8 36.19,60.8 v38.1,58.89 | v138.42,51.91 138.42,55.08 137.16,56.35 137.16,58.13 137.28,58.25 IC11.5
BBQ15  (via drill 0.6)
  Top 0.406: '11.5 40,4.28 40,9.36 v39.37,10 | v36.83,50.63 36.83,51.91 37.46,52.54 37.46,56.98 v38.1,57.62 | v34.29,56.35 33.65,56.98 29.84,56.98 29.2,57.62 IC2.13 IC2.14 | IC10.5 149.35,48.09 149.98,48.73 149.98,59.65 146.93,62.7 142.11,62.7 140.97,63.84 140.97,67.27 140.46,67.78 128.77,67.78 128.27,67.27 v128.27,63.97 | v124.33,64.1 122.93,62.7 120.26,62.7 v119.5,62.95 | v28.57,65.88 34.03,65.88 35.17,67.02 38.6,67.02 v39.37,67.78 | v41.14,88.1 41.65,87.59 57.27,87.59 v57.91,88.23 | v68.07,87.97 68.96,87.97 69.34,87.59 84.2,87.59 v84.83,88.23 | v87.62,85.94 87.88,86.07 88.89,87.08 88.89,87.47 89.28,87.85 89.53,87.97 117.6,87.97 v118.74,86.83
  Bottom 0.406: v39.37,10 40.64,11.27 40.64,50 39.37,51.27 37.46,51.27 v36.83,50.63 | v38.1,57.62 35.55,57.62 v34.29,56.35 | v128.27,63.97 126.49,63.97 126.23,64.22 124.71,64.22 v124.33,64.1 | IC2.13 29.2,60.8 29.33,60.92 29.33,65.11 v28.57,65.88 | v39.37,67.78 39.37,68.8 38.98,69.18 38.98,75.53 40.38,76.92 40.38,87.34 v41.14,88.1 | v57.91,88.23 57.91,92.29 58.8,93.18 67.3,93.18 68.07,92.42 v68.07,87.97 | v84.83,88.23 85.34,88.23 v87.62,85.94 | v118.74,86.83 118.74,66 119.12,65.88 v119.5,62.95
BBQ16  (via drill 0.6)
  Top 0.406: R44.1 49.53,18.88 60.32,18.88 60.96,19.52 70.48,19.52 71.11,18.88 71.11,16.34 JP2.3 | '11.6 40.64,9.36 v41.27,10
  Bottom 0.406: R44.1 46.35,18.25 43.18,15.71 43.18,11.9 v41.27,10
BBQ17  (via drill 0.6)
  Top 0.305: v130.68,70.7 131.06,70.7 131.31,70.45 136.27,70.45 v137.16,71.34
  Top 0.406: IC3.12 IC3.11 | '11.7 41.27,4.28 41.27,8.09 42.54,9.36 42.54,10.63 41.91,11.27 38.1,11.27 v36.83,10 | v38.1,46.19 38.73,46.82 61.59,46.82 v62.86,45.55 | IC11.10 139.44,65.88 139.57,65.75 IC11.9 139.69,63.59 141.6,61.68 146.3,61.68 147.82,60.16 147.82,58.25 147.95,58.13 IC10.1 | v74.04,57.75 74.42,58.13 123.19,58.13 125.85,60.67 130.3,60.67 v130.81,60.16
  Bottom 0.305: IC5.13 132.07,55.33 130.81,56.6 v130.81,60.16 130.81,70.57 v130.68,70.7 | IC11.10 137.28,65.88 137.16,66 v137.16,71.34
  Bottom 0.406: v36.83,10 38.1,11.27 v38.1,46.19 | v62.86,45.55 63.5,45.55 66.03,48.09 66.03,57.62 IC3.12 | IC8.13 IC8.4 | IC8.13 131.95,19.65 | IC7.4 132.07,23.46 | IC7.4 IC8.13 | IC7.4 IC7.13 IC6.4 132.07,42.25 131.95,42.38 IC6.13 IC5.4 | IC5.4 131.95,46.32 | IC5.13 IC5.4 | IC3.11 72.89,58.89 v74.04,57.75
BBQ18  (via drill 0.6)
  Top 0.406: IC2.11 IC2.12 31.74,60.8 v30.47,62.06 | '11.8 45.72,3.64 46.98,4.92 46.98,10 v47.62,10.63 | v50.8,55.71 50.16,56.35 43.18,56.35 v42.54,55.71
  Bottom 0.406: v47.62,10.63 48.89,10.63 50.16,11.9 50.16,20.15 50.8,20.79 v50.8,55.71 | v42.54,55.71 42.54,57.62 38.1,62.06 v30.47,62.06
BBQ19  (via drill 0.6)
  Top 0.406: '11.9 48.26,8.09 v50.16,10 | v46.35,15.08 v46.35,20.15 | v43.18,50.63 43.18,54.45 v43.81,55.08 | v44.45,72.22 55.24,72.22 55.88,71.59 IC15.8
  Bottom 0.406: v50.16,10 49.53,9.36 46.35,9.36 45.72,10 45.72,14.44 v46.35,15.08 | v46.35,20.15 45.72,20.79 45.72,49.37 45.08,50 43.81,50 v43.18,50.63 | v43.81,55.08 43.81,59.52 44.45,60.16 v44.45,72.22
BBQ20  (via drill 0.6)
  Route2 0.406: v80.13,50.63 81.02,51.4 81.02,52.16 80,53.17 76.07,53.17 | 76.07,53.17 72.51,53.17 71.24,54.45 66.92,54.45 65.27,52.79 64.13,52.79 63.62,52.29 63.62,50 62.99,49.37 58.67,49.37 58.41,49.11 58.41,47.59 53.34,42.51 53.34,19.39 54.73,18 54.73,15.84 53.34,14.44 53.34,5.04 50.8,2.5 '11.10 | IC5.2 126.87,46.19 120.64,52.41 120.39,52.41 118.61,54.19 116.2,54.19 111.75,58.64 99.94,58.64 98.29,60.29 98.29,62.45 97.66,63.08 76.45,63.08 76.19,62.83 76.19,53.3 76.07,53.17
  Route15 0.406: IC12.18 89.91,30.95 87.88,32.98 83.81,32.98 83.81,35.78 84.7,36.79 84.7,40.6 83.56,41.87 83.56,44.28 82.8,45.05 81.66,45.05 79.75,46.95 79.75,50.25 v80.13,50.63
BBQ21  (via drill 0.6)
  Top 0.406: v78.73,54.45 78.73,52.29 v79.24,51.78
  Route2 0.406: v79.24,51.78 77.97,51.78 77.21,51.02 75.43,51.02 74.04,52.41 72.13,52.41 70.99,53.56 67.56,53.56 66.03,52.03 66.03,50 63.62,47.59 61.84,47.59 61.34,47.08 60.32,47.08 55.88,42.63 55.88,18.12 57.02,16.98 57.02,15.58 55.88,14.44 55.88,4.92 '21.1 | IC5.3 129.53,45.68 128.77,44.92 123.82,44.92 122.8,45.94 122.8,48.86 120.39,51.27 114.93,51.27 113.15,53.05 113.15,55.21 110.74,57.62 99.18,57.62 96.77,60.03 82.29,60.03 81.66,59.4 81.66,58.38 80.77,57.49 80.77,56.48 v78.73,54.45
  Route15 0.406: IC12.17 92.7,31.2 91.05,32.85 89.91,32.85 88.89,33.87 88.89,38.82 86.35,41.36 86.35,43.02 82.16,47.21 82.16,48.35 81.27,49.24 81.27,51.78 v79.24,51.78
BBQ22  (via drill 0.6)
  Top 0.406: v81.27,54.45 81.27,49.87 80.89,49.49 79.37,49.49 78.48,50.38 v78.48,50.51
  Route2 0.406: v78.48,50.51 77.97,50 75.18,50 73.66,51.52 71.62,51.52 70.35,52.79 69.21,52.79 68.57,52.16 68.57,50.51 67.43,49.24 66.67,48.35 65.02,46.7 62.35,46.7 61.84,46.19 60.57,46.19 58.29,43.9 58.29,21.42 60.45,19.27 65.4,19.27 66.03,18.63 66.03,12.54 '21.2 | IC5.6 137.16,45.43 135.76,44.03 135.76,39.71 135,38.95 127.25,38.95 125.72,40.48 125.72,43.14 125.22,43.65 123.69,43.65 121.79,45.55 121.79,45.81 120.26,47.33 120.26,49.49 119.38,50.38 114.17,50.38 112.26,52.29 99.44,52.29 99.05,52.67 99.05,55.84 96.13,58.76 82.93,58.76 82.8,58.64 82.8,58.13 81.91,57.24 81.91,55.08 v81.27,54.45
  Route15 0.406: IC12.16 95.24,30.57 91.82,27.27 85.59,27.39 79.12,33.87 79.12,37.68 81.91,39.84 81.91,43.65 78.48,45.05 v78.48,50.51
BBQ23  (via drill 0.6)
  Route2 0.406: '21.3 68.57,12.54 68.57,18.76 67.18,20.28 61.84,20.28 60.83,21.3 60.83,33.62 64.89,37.68 64.89,40.35 66.54,42 68.32,42 69.72,43.27 69.72,48.73 70.35,49.37 70.35,49.87 71.11,50.63 73.27,50.63 74.8,49.11 81.78,49.11 v82.55,49.87 82.55,53.81 86.35,57.62 94.61,57.62 96.52,55.71 96.52,52.54 97.66,51.4 111.63,51.4 116.45,46.57 116.45,45.17 117.09,44.54 118.23,44.54 120.01,42.76 121.53,42.76 126.23,38.06 135.5,38.06 137.16,39.71 137.16,40.48 138.42,41.74 138.42,44.03 139.69,45.3 IC5.7
  Route15 0.406: IC12.15 97.78,31.46 97.02,32.22 93.09,32.22 91.44,33.87 91.44,38.57 88.89,41.11 88.89,43.78 87.12,45.55 85.08,45.55 83.43,47.21 83.43,49.11 v82.55,49.87
BBQ24  (via drill 0.6)
  Route2 0.406: v84.96,53.56 84.96,53.68 | v84.96,53.56 84.96,49.37 84.07,48.48 84.07,45.05 82.42,43.4 82.42,41.49 82.04,41.11 82.04,40.35 81.66,39.97 81.66,39.08 79.5,36.92 79.5,30.82 78.73,30.06 78.73,23.58 73.66,18.5 73.66,13.04 69.21,8.6 67.3,8.6 60.96,2.25 '21.4 | IC6.2 126.87,34.76 124.96,36.66 124.96,36.92 123.31,38.57 121.15,38.57 119.76,39.97 119.76,41.62 117.85,43.52 116.58,43.52 115.44,44.67 115.44,46.44 111.25,50.51 95.12,50.51 93.85,51.78 93.85,55.21 92.45,56.6 86.74,56.6 84.96,54.83 v84.96,53.56
  Route15 0.406: IC12.14 100.32,31.71 98.93,33.11 94.74,33.11 93.97,33.87 93.97,38.57 91.44,41.11 91.44,42.89 92.96,44.41 95.5,44.41 95.88,44.79 98.17,44.79 99.05,45.68 99.05,48.6 97.66,50 86.86,50 84.83,52.03 84.83,53.56 v84.96,53.56
BBQ25  (via drill 0.6)
  Top 0.305: v104.26,37.94 105.02,37.94 105.79,37.17 119.88,37.17 121.53,35.52 122.8,35.52 123.82,36.54 129.03,36.54 129.53,36.03 IC6.3 129.53,34.63
  Route2 0.406: v87.62,54.57 87.62,50.76 84.96,48.09 84.96,44.67 83.56,43.27 83.56,41.87 84.58,40.86 84.58,38.57 81.91,35.9 81.53,35.27 81.53,33.11 82.67,31.97 82.67,24.09 78.1,19.52 77.34,19.52 76.19,18.38 76.19,13.93 66.8,4.53 65.65,4.53 '21.5
  Route15 0.406: IC12.13 102.86,32.73 104.13,34 104.13,35.52 101.59,38.06 101.59,50.25 100.96,50.89 90.04,50.89 87.75,53.17 87.75,54.45 v87.62,54.57
  Bottom 0.305: IC12.13 102.86,31.58 104.13,32.85 104.13,37.81 v104.26,37.94
BBQ26  (via drill 0.6)
  Route2 0.406: '21.6 76.83,13.17 78.1,13.17 78.73,13.81 78.73,18.76 83.81,23.84 83.81,35.78 85.97,37.94 86.35,37.94 86.35,45.55 88.89,48.6 v88.89,54.06 88.89,55.46 89.15,55.71 90.93,55.71 91.31,55.33 91.31,53.81 91.18,53.68 91.18,51.14 92.7,49.62 110.23,49.62 113.15,46.7 113.15,43.27 114.3,42.13 115.31,42.13 120.26,37.17 120.26,35.52 121.28,34.51 121.28,33.36 120.9,32.98 120.9,32.6 123.95,29.55 132.58,29.55 133.34,30.31 133.34,31.58 134.11,32.35 135.25,32.35 137.16,34.25 IC6.6
  Route15 0.406: IC12.12 105.41,32.6 106.67,33.87 106.67,36.03 105.41,37.3 105.41,38.82 104.13,40.09 104.13,50.89 103.25,51.78 90.55,51.78 88.89,53.43 v88.89,54.06
BBQ27  (via drill 0.6)
  Route2 0.406: 90.16,48.48 v90.16,54.57 | 90.16,48.48 87.88,46.19 87.88,45.05 88.64,44.28 88.89,43.9 88.89,26.89 86.35,24.35 86.35,21.04 83.81,18.5 83.81,13.17 83.18,12.54 81.4,12.54 80.77,13.17 79.5,13.17 78.61,12.28 78.1,12.28 68.57,2.76 '21.7 | IC6.7 139.69,34.12 137.92,32.35 136.52,32.35 136.01,31.84 136.01,31.58 135.88,31.46 135.88,30.19 134.49,28.79 123.44,28.79 119.63,32.6 119.5,32.6 119.12,32.98 117.98,32.98 116.33,34.63 116.33,39.71 114.8,41.24 113.66,41.24 112.39,42.51 112.39,45.81 109.72,48.48 90.16,48.48
  Route15 0.406: IC12.11 107.94,32.35 109.34,34.51 109.34,35.78 106.67,38.44 106.67,51.4 105.41,52.67 91.94,52.67 v90.16,54.57
BBQ28
  Route2 0.406: '21.8 78.99,10.25 80,10.25 81.02,11.27 85.85,11.27 86.35,11.77 86.35,18.5 88.89,21.04 88.89,24.22 91.44,26.76 91.44,35.27 90.16,36.54 IC13.18 90.16,45.68 91.94,47.46 108.58,47.46 109.21,46.82 109.21,41.36 110.48,40.09 114.17,40.09 115.18,39.08 115.18,34.12 117.34,31.97 119.12,31.97 125.34,25.74 129.53,25.74 130.81,24.47 130.81,22.44 130.04,21.68 128.65,21.68 IC7.2
BBQ29  (via drill 0.6)
  Route2 0.406: IC13.17 92.7,36.66 93.97,35.39 93.97,26.89 | 93.97,26.89 91.44,24.35 91.44,21.04 88.89,18.5 88.89,11.65 87.5,10.25 81.53,10.25 '21.9 | 93.97,26.89 93.97,26.5 v94.36,26.12 | v109.85,38.32 114.04,38.32 114.17,38.19 114.17,33.36 116.45,31.08 118.74,31.08 124.96,24.85 128.14,24.85 129.66,23.33 IC7.3
  Route15 0.406: v94.36,26.12 109.47,26.12 110.99,27.65 110.99,30.7 109.34,32.98 110.61,35.01 110.61,37.55 v109.85,38.32
BBQ30  (via drill 0.6)
  Route2 0.406: v96.52,36.28 96.52,26.76 93.97,24.22 93.97,21.17 v92.83,20.03 | v92.7,12.66 92.45,12.41 92.96,11.9 92.96,9.49 92.2,8.73 83.94,8.73 83.31,9.36 82.16,9.36 80.77,7.96 80.77,6.82 76.19,2.25 '21.10
  Route15 0.406: IC13.16 95.24,42.63 96.39,43.78 98.04,43.78 99.05,42.76 99.05,38.57 v96.52,36.28 | v92.7,12.66 93.97,14.19 93.97,18.63 92.83,19.77 v92.83,20.03 93.85,21.04 107.31,21.04 107.94,20.41 107.94,19.39 108.33,19.01 108.45,19.01 109.09,18.38 110.1,18.38 111.63,19.9 117.72,20.03 120.52,18 121.66,18 123.69,15.96 135.25,15.96 135.88,16.6 135.88,22.19 137.03,23.33 IC7.6
BBQ31  (via drill 0.6)
  Route2 0.406: IC13.15 96.9,42.38 95.88,41.36 95.75,41.36 95.12,40.73 95.12,39.33 99.05,35.39 99.05,26.76 96.52,24.22 96.52,21.42 93.97,18.88 93.97,10.12 | 93.97,10.12 93.97,8.6 93.09,7.71 84.07,7.71 '31.1 | 93.97,10.12 v94.74,10.12
  Route15 0.406: IC7.7 138.42,22.06 138.42,16.98 136.52,15.08 123.19,15.08 121.28,16.98 118.61,16.98 116.07,14.44 116.07,13.17 114.93,12.03 109.21,12.03 107.69,13.55 95.75,13.55 94.74,12.54 v94.74,10.12
BBQ32  (via drill 0.6)
  Route2 0.406: IC13.14 100.32,40.86 99.31,39.84 99.31,38.19 101.59,35.9 101.59,26.89 99.18,24.47 99.18,24.35 99.05,24.22 99.05,20.66 97.66,19.27 97.53,19.27 97.15,18.88 96.9,18.88 96.52,18.5 96.52,13.04 98.55,11.01 | 98.55,11.01 98.55,7.96 97.28,6.69 85.47,6.69 81.15,2.38 '31.2 | 98.55,11.01 99.69,11.01 v100.2,10.5
  Route15 0.406: v100.2,10.5 100.58,10.5 102.74,12.66 107.06,12.66 110.23,9.61 112.26,9.61 113.79,11.14 118.49,11.14 120.01,9.61 124.84,9.61 127.12,11.9 IC8.2
BBQ33  (via drill 0.6)
  Route2 0.406: IC13.13 102.86,40.35 101.59,39.08 101.59,37.94 102.86,36.66 103.25,36.66 104.13,35.78 104.13,30.57 102.86,29.3 102.86,25.62 101.59,24.35 101.59,6.95 | 101.59,6.95 100.45,5.8 87.24,5.8 '31.3 | 101.59,6.95 101.59,10.5 101.72,10.63 102.48,10.63 v102.61,10.5
  Route15 0.406: v102.61,10.5 103.12,10.5 104.52,11.9 106.42,11.9 109.47,8.73 126.49,8.73 129.66,11.9 IC8.3
BBQ34  (via drill 0.6)
  Route2 0.406: IC13.12 105.41,36.66 106.67,35.39 106.67,26.76 104.13,24.22 104.13,6.82 | 104.13,6.82 102.23,4.92 89.02,4.92 86.35,2.25 '31.4 | 104.13,6.82 104.13,10.5 104.26,10.63 v105.15,10.63
  Route15 0.406: v105.15,10.63 108.07,7.71 135.38,7.71 137.16,9.49 IC8.6
BBQ35
  Route2 0.406: IC13.11 107.94,37.17 109.34,35.78 109.34,30.44 108.33,29.43 108.33,26 106.67,24.35 106.67,21.68 107.82,20.54 107.82,19.65 106.67,18.5 106.67,5.93 106.61,5.87 | 106.61,5.87 104.9,4.15 90.67,4.15 '31.5 | IC8.7 139.69,11.14 135.38,6.82 122.55,6.82 120.52,4.79 107.69,4.79 106.61,5.87 | 106.61,5.87 106.55,5.93
BBQ38  (via drill 0.6)
  Top 0.305: v80,12.15 JP3.5 | 96.01,11.77 v96.01,11.65 96.01,10 96.52,9.49 '31.8 96.39,2.25
  Bottom 0.305: v80,12.15 80.13,12.15 80.51,11.77 91.94,11.77 92.2,11.52 93.21,11.52 93.59,11.9 96.01,11.9 v96.01,11.65
BBQ39  (via drill 0.6)
  Top 0.305: v99.05,19.01 '31.9 | v99.05,44.28 93.47,44.28 92.7,45.05 IC4.1
  Top 0.406: IC2.18 16.5,60.16 17.14,60.8 24.76,60.8 25.39,60.16 25.39,56.98 26.66,55.71 33.02,55.71 v34.29,54.45 | v45.08,53.81 46.98,53.81 47.62,53.17 74.16,53.17 78.61,48.73 86.99,48.73 88.26,47.46 88.89,47.46 90.16,46.19 IC4.1 | IC9.3 151.12,24.6 153.66,22.06 IC9.11 | v140.97,32.85 110.87,32.85 v110.61,33.11 | v99.05,44.28 v110.61,44.28
  Bottom 0.305: v99.05,44.28 v99.05,19.01
  Bottom 0.406: v45.08,53.81 34.92,53.81 v34.29,54.45 | IC9.3 146.93,24.6 146.17,25.36 146.17,26.25 143.38,29.04 141.47,29.04 140.97,29.55 v140.97,32.85 | v110.61,44.28 110.61,39.33 110.99,38.95 110.99,37.68 110.61,37.3 v110.61,33.11
BBQ40  (via drill 0.6)
  Top 0.305: '31.10 101.59,3.26 107.31,8.98 110.87,8.98 110.99,9.11 110.99,11.27 v113.66,13.93 | v114.17,45.94 114.42,46.19 IC5.1 124.58,46.06
  Bottom 0.305: v113.66,13.93 113.66,16.73 113.41,16.98 113.41,20.41 112.39,21.42 112.39,26.76 113.15,27.52 113.15,28.54 112.39,29.3 112.39,29.93 113.66,31.2 113.66,45.43 v114.17,45.94
BBQ41  (via drill 0.6)
  Top 0.305: '41.1 104.13,3.52 108.83,8.22 111.5,8.22 111.75,8.47 111.75,11.01 113.53,12.79 115.44,12.79 115.69,13.04 115.69,22.06 v114.68,23.08 | v114.68,53.94 121.03,53.94 123.69,51.27 127.5,51.27 127.76,51.02 128.9,51.02 129.53,51.65 129.53,53.68 129.66,53.81 IC5.14
  Bottom 0.305: v114.68,23.08 114.68,23.2 115.06,23.58 115.06,53.56 v114.68,53.94
BBQ42  (via drill 0.6)
  Top 0.305: '41.2 106.67,3.77 110.23,7.33 112.14,7.33 112.52,7.71 112.52,10.76 113.79,12.03 116.07,12.03 116.33,12.28 116.33,19.27 117.6,20.54 117.98,20.54 v118.49,21.04 | v119.12,48.86 132.58,48.86 v133.09,48.35
  Bottom 0.305: v118.49,21.04 119.25,21.81 119.25,31.97 118.23,32.98 118.23,34.51 119.38,35.65 119.38,48.6 v119.12,48.86 | v133.09,48.35 133.09,50.76 133.34,51.02 133.34,55.21 133.85,55.71 136.01,55.71 137.16,54.57 137.16,53.94 137.28,53.81 IC5.11
BBQ43  (via drill 0.6)
  Top 0.305: '41.3 109.21,3.77 111.88,6.44 112.52,6.44 113.15,7.07 113.15,10.38 114.04,11.27 116.45,11.27 116.96,11.77 116.96,18.88 117.85,19.77 119.12,19.77 v119.38,20.03 | v121.41,44.28 141.35,44.28 142.23,45.17 IC5.8
  Bottom 0.305: v119.38,20.03 119.88,20.54 119.88,32.35 118.87,33.36 118.87,34.25 120.01,35.39 120.01,42.89 v121.41,44.28
BBQ44  (via drill 0.6)
  Top 0.305: '41.4 111.75,3.52 114.04,5.8 114.17,5.8 114.3,5.93 118.74,5.93 119.38,6.57 119.38,13.55 118.61,14.31 118.61,14.57 v118.23,14.95 | v120.01,34 122.55,34 123.31,34.76 IC6.1
  Bottom 0.305: v118.23,14.95 118.23,16.09 118.87,16.73 119.88,16.73 120.52,17.36 120.52,33.49 v120.01,34
BBQ45  (via drill 0.6)
  Top 0.305: '41.5 114.3,3.52 115.95,5.17 116.07,5.17 116.2,5.3 119.12,5.3 120.01,6.18 120.01,13.81 119.63,14.19 119.63,15.58 v119.38,15.84 | v121.03,41.36 122.8,41.36 123.69,40.48 129.15,40.48 129.53,40.86 IC6.14
  Bottom 0.305: v119.38,15.84 120.39,15.84 121.15,16.6 121.15,35.27 120.64,35.78 120.64,37.43 121.41,38.19 121.41,40.98 v121.03,41.36
BBQ46  (via drill 0.6)
  Top 0.305: '41.6 116.83,3.77 117.72,4.66 119.5,4.66 120.64,5.8 120.64,14.69 v120.52,14.82 | v122.3,40.35 122.8,39.84 122.93,39.84 123.06,39.71 138.04,39.71 v138.42,40.09
  Bottom 0.305: v120.52,14.82 121.79,16.09 121.79,35.78 121.28,36.28 121.28,37.05 122.3,38.06 v122.3,40.35 | IC6.11 137.28,42.51 138.42,41.36 v138.42,40.09
BBQ47  (via drill 0.6)
  Top 0.305: '41.7 119.38,3.64 121.28,5.55 121.28,13.55 v121.66,13.93 | v122.42,36.66 123.06,37.3 132.71,37.3 v133.22,36.79
  Bottom 0.305: v121.66,13.93 121.66,14.06 122.42,14.82 v122.42,36.66 | v133.22,36.79 141.09,36.79 142.23,35.65 IC6.8
BBQ48  (via drill 0.6)
  Top 0.305: '41.8 121.91,12.54 v123.19,13.81
  Bottom 0.305: IC7.1 124.33,23.33 123.19,22.19 v123.19,13.81
BBQ49  (via drill 0.6)
  Top 0.305: v128.27,13.93 128.27,8.09 124.45,4.28 '41.9 124.45,2.25
  Bottom 0.305: IC7.14 129.53,26 128.27,24.73 v128.27,13.93
BBQ50
  Route2 0.406: '41.10 126.99,4.41 128.27,5.68 141.73,5.68 146.04,10 146.04,23.71 143.5,26.25 138.3,26.25 137.03,27.52 137.03,30.57 137.41,30.95 IC7.11
BBQ51  (via drill 0.6)
  Top 0.305: IC7.8 142.23,22.57 141.09,21.42 v125.72,21.42 | v125.72,14.06 125.72,6.69 v123.19,4.03
  Bottom 0.305: v125.72,14.06 v125.72,21.42 | v123.19,4.03 123.44,4.41 128.65,4.41 129.53,3.52 '51.1 129.53,2.25
BBQ52  (via drill 0.6)
  Top 0.305: v130.81,10.5 132.07,9.23 '51.2
  Bottom 0.305: IC8.1 124.45,11.27 125.6,10.12 130.42,10.12 v130.81,10.5
BBQ53  (via drill 0.6)
  Top 0.305: v130.68,13.81 132.71,13.81 133.34,13.17 133.34,9.36 134.62,8.09 '51.3
  Route15 0.406: IC8.14 130.81,20.79 130.81,58.76 129.79,59.78 129.79,63.97 128.27,65.49 128.27,68.67 127.12,69.81 124.07,69.81 122.42,69.81 121.28,68.67 115.06,68.67 112.9,70.83 58.92,70.83 56.89,68.8 54.86,68.8 IC15.9
  Bottom 0.305: IC8.14 129.53,15.58 130.81,14.31 130.81,13.93 v130.68,13.81
BBQ54  (via drill 0.6)
  Top 0.305: '51.4 137.16,8.09 138.42,9.36 v138.42,14.06
  Route15 0.406: IC15.1 40.64,62.57 42.16,61.05 43.81,61.05 44.45,61.68 44.45,70.83 43.18,72.1 43.18,72.86 40.25,75.78 36.95,75.78 36.32,76.42 36.32,81.11 37.21,82 40.51,82 40.76,81.75 55.88,81.75 57.53,80.1 59.3,80.1 60.96,81.75 92.7,81.75 93.72,82.77 96.13,82.77 97.02,81.88 97.15,81.88 97.15,81.75 133.73,81.75 135.12,80.35 140.46,80.35 141.22,79.59 141.22,69.3 144.01,66.64 144.01,52.79 145.16,51.91 145.16,40.86 144.65,40.35 144.65,38.44 145.28,37.81 145.28,33.49 144.78,32.98 144.78,31.08 145.79,30.06 145.79,20.03 139.82,14.06 v138.42,14.06
  Bottom 0.305: v138.42,14.06 138.42,14.95 137.54,15.84 134.49,15.84 133.47,16.85 133.47,20.79 134.11,21.42 136.77,21.42 137.16,21.04 IC8.11 137.28,19.39
BBQ55
  Top 0.305: '51.5 139.69,6.82 142.23,9.36 IC8.8
  Route15 0.406: IC8.8 142.23,15.2 146.68,19.65 146.68,30.31 148.08,31.71 148.08,34.76 147.44,35.39 147.44,38.06 148.2,38.82 148.2,40.73 146.43,42.51 146.43,52.41 144.9,53.81 144.9,87.59 134.36,98.13 85.21,98.13 82.67,95.59 82.67,89.5 78.61,85.43 77.08,85.43 74.8,83.15 73.27,83.15 71.5,84.92 41.78,84.92 39.75,82.89 36.95,82.89 35.3,81.24 35.3,76.03 36.32,74.89 39.75,74.89 41.91,72.73 41.91,64.1 43.3,62.7 IC15.2
BBQ56  (via drill 0.6)
  Top 0.406: IC14.11 IC14.10 IC14.9 27.3,68.41 31.74,68.41 32.38,67.78 37.46,67.78 v38.1,68.41 | v39.37,87.47 40,86.83 85.08,86.83 86.99,88.73 154.94,88.73 158.11,85.56 158.11,41.74 158.75,41.11 158.75,37.94 v157.47,36.66 | v151.25,11.01 151.12,10.88 151.12,5.42 150.62,4.92 143.5,4.92 142.23,3.64 '51.6
  Bottom 0.406: v38.1,68.41 38.1,76.03 39.37,77.3 v39.37,87.47 | v157.47,36.66 153.03,32.22 153.03,12.54 v151.25,11.01
BBQ57
  Route15 0.406: IC2.3 16.5,51.4 22.73,57.62 22.73,58.13 22.86,58.25 22.86,60.16 21.58,61.43 21.58,63.59 20.7,64.48 12.57,64.48 7.23,59.14 7.23,31.33 7.62,30.95 7.62,24.73 4.31,21.42 4.31,15.58 5.58,14.31 5.58,8.73 8.89,5.42 143.38,5.42 144.78,4.03 '51.7 144.65,2.25
BBQ58
  Route15 0.406: '51.8 147.31,3.39 144.01,6.69 88.39,6.69 85.08,10 85.08,14.82 84.96,14.95 JP4.3
BBQ59  (via drill 0.6)
  Top 0.406: v67.3,6.82 JP1.5 | '51.9 149.85,2.5 151.89,4.79 152.01,4.92 153.41,4.92 153.79,5.3 v153.79,7.2
  Bottom 0.406: v67.3,6.82 153.28,6.82 v153.79,7.2
BBQ62  (via drill 0.6)
  Top 1.27: v7.62,20.15 7.62,25.23 10.79,28.41 10.79,33.49 v11.43,34.12 | v5.08,35.39 1.9,38.57 v1.9,74.13
  Bottom 1.27: '51.12 157.47,3.64 155.57,5.55 68.19,5.55 67.81,5.17 66.8,5.17 66.42,5.55 7.62,5.55 5.08,8.09 5.08,17.61 v7.62,20.15 | v11.43,34.12 8.25,34.12 6.98,35.39 v5.08,35.39 | v1.9,74.13 3.8,76.03 8.89,76.03 10.79,77.94 10.79,84.29 S1.2
CLCI
  Top 0.406: JP3.6 JP3.4 JP3.2
  Route15 0.406: IC1.16 49.53,22.44 50.8,21.17 50.8,17.61 53.21,15.2 57.4,15.2 61.59,19.39 74.04,19.39 75.05,18.38 75.05,17.61 JP3.2
CLCI2
  Bottom 0.406: QG1.5 76.83,34.12 77.46,33.49 77.46,29.68 81.91,25.23 81.91,23.96 78.73,20.79 78.73,16.34 JP3.3
CLCIB
  Top 0.406: IC14.4 IC14.3
  Route15 0.406: IC14.4 20.31,57.37 17.14,54.19 16,54.19 14.22,55.97 12.57,55.97 8.76,52.16 8.76,24.35 5.46,21.04 5.46,16.22 14.47,7.2 65.53,7.2 66.54,8.22 67.81,8.22 68.83,7.2 69.84,7.2 74.8,12.15 74.8,15.2 JP3.1
CLCO
  Route15 0.406: IC2.2 13.71,51.27 9.77,47.33 9.77,22.44 11.68,20.54 11.68,11.77 15.11,8.34 43.05,8.34 45.84,11.14 45.84,12.66 47.87,14.69 47.87,17.23 50.03,19.39 50.03,20.28 48.26,22.06 47.62,22.06 IC1.15 46.86,22.82
GND  (via drill 0.6)
  Top 0.406: v86.35,36.41 86.23,36.54 85.97,36.54 85.85,36.66 81.27,36.66 C13.-
  Top 1.27: IC2.10 34.29,51.91 36.19,53.81 36.19,62.06 34.29,63.97 | 34.29,63.97 C15.- 29.2,63.97 IC14.7 27.93,63.97 26.03,65.88 12.06,65.88 v11.43,66.51 | IC15.7 55.88,64.61 54.61,65.88 36.19,65.88 34.29,63.97 | IC12.10 111.12,23.33 112.39,24.6 C7.- | IC13.10 111.12,34.76 112.39,36.03 C6.- | IC4.7 111.12,46.19 112.39,47.46 C5.- | C4.- 85.72,46.82 78.73,46.82 74.29,51.27 IC3.10 | v82.55,8.09 JP4.1
  Bottom 0.406: IC12.19 87.62,31.58 86.35,32.85 v86.35,36.41
  Bottom 1.27: '1.1 2.54,22.7 | 2.54,22.7 2.54,29.68 3.8,30.95 | 3.8,30.95 C1.- | 3.8,30.95 3.8,32.22 2.54,33.49 2.54,52.54 | 2.54,52.54 2.54,63.97 3.17,64.61 C14.- 6.98,66.51 v11.43,66.51 | 10.16,52.54 IC2.1 | 26.03,88.1 S3.1 28.77,88.3 PAD1.1 | S2.1 25.83,88.3 26.03,88.1 | 2.54,52.54 C2.- 10.16,52.54 | 59.69,8.09 12.7,8.09 11.43,9.36 IC1.1 2.54,22.7 | 59.69,8.09 66.29,8.09 66.54,8.34 68.07,8.34 68.32,8.09 v82.55,8.09 116.2,8.09 | 116.2,8.09 147.95,8.09 IC9.7 | 116.2,13.17 C8.- | 116.2,8.09 116.2,13.17 | 116.2,24.6 C7.- | 116.2,13.17 116.2,24.6 | 116.2,36.03 C6.- | 116.2,24.6 116.2,36.03 | 116.2,47.46 C5.- | 116.2,36.03 116.2,47.46 | C11.- 116.2,59.52 116.2,47.46 | IC9.7 151.76,14.44 151.76,36.66 | 151.76,36.66 151.76,41.11 149.85,43.02 IC10.7 146.68,43.02 146.55,43.14 | 151.76,36.66 C9.- | 59.69,8.09 IC1.20 59.69,26.5 62.23,29.04 69.84,29.04 | 69.84,29.04 71.11,29.04 QG1.4 78.73,26.5 C12.- | 69.84,29.04 69.84,36.03 | 69.84,36.03 IC3.10 | IC2.10 35.55,52.54 C3.- 43.81,52.54 45.08,51.27 IC3.1 | IC2.19 13.97,56.35 10.16,52.54 | 69.84,36.03 C13.- | IC3.19 49.53,56.98 46.98,54.45 IC3.1 | IC3.1 46.98,50.63 | 26.03,88.1 28.57,88.1 30.47,86.19 30.47,66.51 C15.- | C10.- 147.31,65.88 142.23,60.8 IC11.7 144.78,55.71 144.78,50 | 146.55,43.14 144.78,44.92 144.78,50 | IC13.19 87.62,43.02 86.35,44.28 C4.- | IC5.12 134.62,51.52 136.14,50 144.78,50 | IC6.12 134.62,40.35 136.39,38.57 141.98,38.57 146.55,43.14 | IC7.12 134.62,28.79 136.39,27.01 142.36,27.01 143.89,25.49 143.89,18 | 143.89,18 143.89,17.74 143.25,17.11 135.25,17.11 134.62,17.74 IC8.12 | IC9.7 147.44,14.44 143.89,18
  pour Bottom: 1.9,98.26 158.75,98.26 158.75,7.46 1.9,7.46
  pour Route2: 1.27,1.1 1.27,59.52 3.17,61.43 78.73,61.43 80,60.16 80,22.06 59.05,1.1
N$1
  Bottom 0.305: IC3.7 62.23,55.08 63.5,56.35 63.5,75.91 64.51,76.92 64.51,82 64.77,82.26 64.77,86.45 62.35,88.86 62.35,91.28 62.99,91.91 LED3.K
N$2  (via drill 0.6)
  Top 0.305: v58.41,81.24 59.05,81.88 93.97,81.88 v94.61,81.24
  Bottom 0.305: IC3.5 57.15,55.08 58.41,56.35 v58.41,81.24 | v94.61,81.24 LED7.K
N$3
  Bottom 0.406: IC3.3 52.07,56.22 51.05,57.24 51.05,57.37 50.8,57.62 50.8,60.16 52.07,61.43 52.07,65.24 49.53,67.78 49.53,74.89 52.7,78.07 52.7,91.78 52.83,91.91 LED1.K
N$4  (via drill 0.6)
  Top 0.305: v65.4,88.23 65.02,88.61 59.94,88.61 v59.69,88.35
  Bottom 0.305: IC3.9 67.3,55.97 68.57,57.24 68.57,74.77 65.4,77.94 v65.4,88.23 | 59.69,92.04 LED2.K v59.69,88.35
N$5
  Route15 0.406: IC2.7 26.66,56.48 27.81,57.62 27.81,58 27.93,58.13 27.93,59.78 28.7,60.54 35.17,60.54 38.35,63.72 38.35,66.13 36.57,67.91 36.57,71.84 33.14,74.77 33.14,82.13 36.57,85.69 36.57,87.34 40,90.77 45.59,90.77 51.56,96.74 68.7,96.74 73.66,91.78 LED4.K
N$6  (via drill 0.6)
  Top 0.406: IC2.5 21.58,54.45 22.22,54.45 v24.12,56.35 | v28.57,72.86 33.65,72.86 v34.29,72.22 | v33.65,86.83 34.29,86.83 35.17,86.07 86.23,86.07 v87.62,87.47
  Bottom 0.406: v24.12,56.35 25.39,57.62 25.39,60.16 26.66,61.43 26.66,65.88 29.2,68.41 29.2,72.22 v28.57,72.86 | v34.29,72.22 34.29,83.02 33.02,84.29 33.02,86.19 v33.65,86.83 | v87.62,87.47 LED6.K
N$7
  Route15 0.406: IC2.9 31.87,51.27 33.27,52.67 34.54,52.67 36.32,54.45 36.32,59.78 39.24,62.7 39.24,65.11 40.89,66.76 40.89,68.03 38.98,69.94 39.11,71.21 34.16,75.4 34.16,81.75 36.57,84.16 38.6,84.16 40.38,85.94 40.38,86.58 77.97,86.58 80.64,89.24 80.64,91.66 80.77,91.78 LED5.K
N$8
  Top 0.406: R38.1 77.46,92.55 79.37,94.45 LED5.A
N$9
  Top 0.406: R37.1 70.48,92.55 72.38,94.45 LED4.A
N$10
  Top 0.406: R39.1 84.45,92.55 86.35,94.45 LED6.A
N$11
  Top 0.406: 102.99,46.19 IC4.5 IC4.4
  Bottom 0.406: IC4.9 105.41,51.4 102.86,48.86 IC4.5
N$12
  Top 0.406: R34.1 49.53,92.55 51.43,94.45 LED1.A
N$13
  Top 0.406: R40.1 91.44,92.55 93.34,94.45 LED7.A
N$14
  Top 0.406: R36.1 63.5,92.55 65.4,94.45 LED3.A
N$15
  Top 0.406: R35.1 56.51,92.55 58.41,94.45 LED2.A
N$16
  Top 0.406: R41.1 98.42,93.18 99.69,94.45 LED8.A
N$17
  Bottom 0.406: IC4.2 95.24,49.11 96.52,50.38 96.52,57.37 98.42,59.27 98.42,75.27 101.59,78.45 LED8.K
N$18
  Top 0.406: R42.1 112.39,92.55 114.3,94.45 LED10.A
N$19
  Bottom 0.406: IC4.6 105.41,48.6 106.67,49.87 106.67,57.11 108.45,58.89 108.58,58.89 108.58,75.4 111.12,77.94 111.12,84.8 115.56,89.24 115.56,91.78 115.69,91.91 LED10.K
N$20  (via drill 0.6)
  Route2 0.406: v73.02,49.24 72.89,49.11 72.89,42.25 70.86,40.48 67.3,40.48 66.54,39.71 66.54,36.79 62.99,33.24 62.99,22.95 63.5,22.44 69.21,22.44 72.38,19.27 JP2.4
  Route15 0.406: v73.02,49.24 76.45,52.92 81.53,52.92 85.72,48.73 87.12,48.73 87.88,47.97 97.28,47.97 97.78,47.46 IC4.3 97.78,46.06
  Bottom 0.406: JP2.4 JP2.2
N$21
  Route15 0.406: JP1.3 64.77,14.19 66.29,12.66 72.38,12.66 73.66,13.93 73.66,15.96 74.04,16.34 75.81,16.34 76.19,16.73 76.19,18.76 76.96,19.52 87.62,19.52 90.04,21.93 108.2,21.93 109.85,23.46 109.21,22.95 114.93,28.66 114.93,43.14 112.9,45.17 112.9,50.89 107.82,55.97 105.79,55.97 104.64,57.11 101.09,57.11 IC4.12
N$22
  Bottom 0.406: IC9.1 147.95,30.31 R48.1
N$23
  Bottom 0.406: IC5.16 124.45,62.32 123.31,63.59 123.31,64.73 124.84,66.13 124.84,69.69 126.36,71.21 LED11.K
N$24
  Top 0.406: RN1.4 104.77,70.32 106.04,71.59 106.04,77.94 LED14.A
N$25
  Top 0.406: RN1.3 107.31,70.32 113.66,76.67 113.66,77.94 LED13.A
N$26
  Top 0.406: RN1.2 109.85,70.32 114.93,75.4 117.47,75.4 118.74,76.67 118.74,77.94 LED12.A
N$27
  Top 0.406: RN1.1 112.39,70.32 116.2,74.13 118.74,74.13 120.01,75.4 122.55,75.4 123.82,76.67 123.82,77.94 LED11.A
N$28  (via drill 0.6)
  Top 0.305: v82.67,35.14 84.7,35.14 IC13.1
  Route2 0.406: v109.6,28.16 109.6,23.58 111.25,21.93 111.25,17.49 112.26,16.47 112.26,16.09 110.61,14.44 108.58,14.44 JP8.3
  Route15 0.406: IC12.1 85.08,25.62 85.97,26.5 92.32,26.5 94.23,28.41 102.74,28.41 104.13,27.01 108.45,27.01 v109.6,28.16
  Bottom 0.305: IC12.1 85.08,27.65 83.31,29.43 83.31,34.51 v82.67,35.14
  Bottom 0.406: 105.28,15.08 JP8.1 JP8.3
N$29
  Top 0.406: RN1.5 102.23,70.32 100.96,71.59 100.96,77.94 LED15.A
N$30
  Top 0.406: RN1.6 99.69,70.32 97.15,72.86 97.15,79.21 LED16.A
N$31
  Top 0.406: LED17.A 93.34,77.94 93.34,74.13 97.15,70.32 RN1.7
N$32
  Top 0.406: RN1.8 94.61,70.32 88.26,76.67 88.26,77.94 LED18.A
N$33
  Top 0.406: RN2.1 90.16,70.32 83.18,77.3 83.18,77.94 LED19.A
N$34
  Top 0.406: RN2.2 87.62,70.32 82.55,75.4 78.73,75.4 76.32,77.43 75.56,77.94 LED20.A
N$35
  Top 0.406: RN2.3 85.08,71.59 82.55,74.13 78.48,74.13 77.59,75.02 77.08,75.02 76.19,74.13 71.75,74.13 70.48,75.4 70.48,77.94 LED21.A
N$36
  Top 0.406: RN2.4 82.55,71.59 81.53,71.59 80.13,72.99 78.23,72.86 77.85,72.48 76.96,72.48 76.58,72.86 66.67,72.86 65.4,74.13 65.4,77.94 LED22.A
N$37
  Top 0.406: RN2.5 80,70.95 79.37,71.59 65.4,71.59 61.59,75.4 59.05,75.4 57.78,76.67 57.78,77.94 LED23.A
N$38
  Top 0.406: LED24.A 56.51,74.13 60.32,74.13 64.13,70.32 68.57,70.32 71.75,67.14 76.83,67.14 77.46,67.78 RN2.6
N$39  (via drill 0.6)
  Top 0.406: LED25.A 52.07,73.5 55.88,73.5 57.78,71.59 61.59,71.59 64.13,69.05 67.94,69.05 71.11,65.88 v74.92,65.88
  Bottom 0.406: v74.92,65.88 RN2.7
N$40  (via drill 0.6)
  Top 0.406: v34.29,84.92 v73.66,84.92
  Bottom 0.406: RN2.8 72.38,70.95 74.92,73.5 74.92,83.66 v73.66,84.92 | v34.29,84.92 37.46,81.75 LED26.A
N$41  (via drill 0.6)
  Top 0.305: v138.68,71.46 137.79,72.35 136.77,72.35 135.76,71.46 132.2,71.46 v132.07,71.59 132.07,71.72 131.95,71.59 121.41,71.59 116.33,66.51 v112.39,66.51 | v91.44,18.88 97.4,18.88 98.55,20.03 v106.55,20.03
  Bottom 0.305: IC11.6 139.69,61.43 138.55,62.57 138.55,71.34 v138.68,71.46 | v132.07,71.59 IC11.12 | JP5.3 91.44,16.34 v91.44,18.88 | v106.55,20.03 106.55,20.28 106.67,20.41 106.67,48.73 109.21,51.27 109.21,58.25 111.12,60.16 111.12,65.24 v112.39,66.51
N$42  (via drill 0.6)
  Top 0.406: v123.06,67.14 124.84,67.14 125.47,66.51 125.47,63.34 v125.72,62.95
  Bottom 0.406: LED12.K 121.28,68.92 v123.06,67.14 | v125.72,62.95 125.34,62.57 125.34,56.22 126.87,54.7 126.87,53.94 IC5.15
N$43  (via drill 0.6)
  Top 0.305: v116.2,72.35 116.71,71.84 119.63,71.84 120.77,72.99 130.81,72.99 131.82,74 v142.23,74
  Bottom 0.305: JP5.1 89.02,13.68 95.37,13.68 96.13,12.92 110.87,12.92 111.63,13.68 111.63,27.01 112.52,27.9 112.52,28.28 111.63,29.17 111.63,30.06 113.02,31.46 113.02,53.05 113.41,53.43 113.41,59.02 114.17,59.78 114.17,68.8 115.95,70.57 115.95,72.1 v116.2,72.35 | v142.23,74 IC11.8
N$44  (via drill 0.6)
  Top 0.305: v135.88,81.75 135.38,82.26 120.64,82.26 116.2,77.81 LED13.K
  Bottom 0.305: IC5.10 139.69,54.83 138.55,55.97 138.55,56.1 138.42,56.22 138.42,61.3 136.01,63.72 136.01,63.84 135.88,63.97 v135.88,81.75